# EasyEDA Pro project ProProject_智能小车驱动板V01_2024-07-14.epro

# Schematic Schematic1
Create Date: 2024-07-03; Page Name: P1; Project Name: 智能小车驱动板V01; Schematic Name: Schematic1; Update Date: 2024-07-11; Company: 嘉立创EDA; Page Size: A4; Version: V1.0
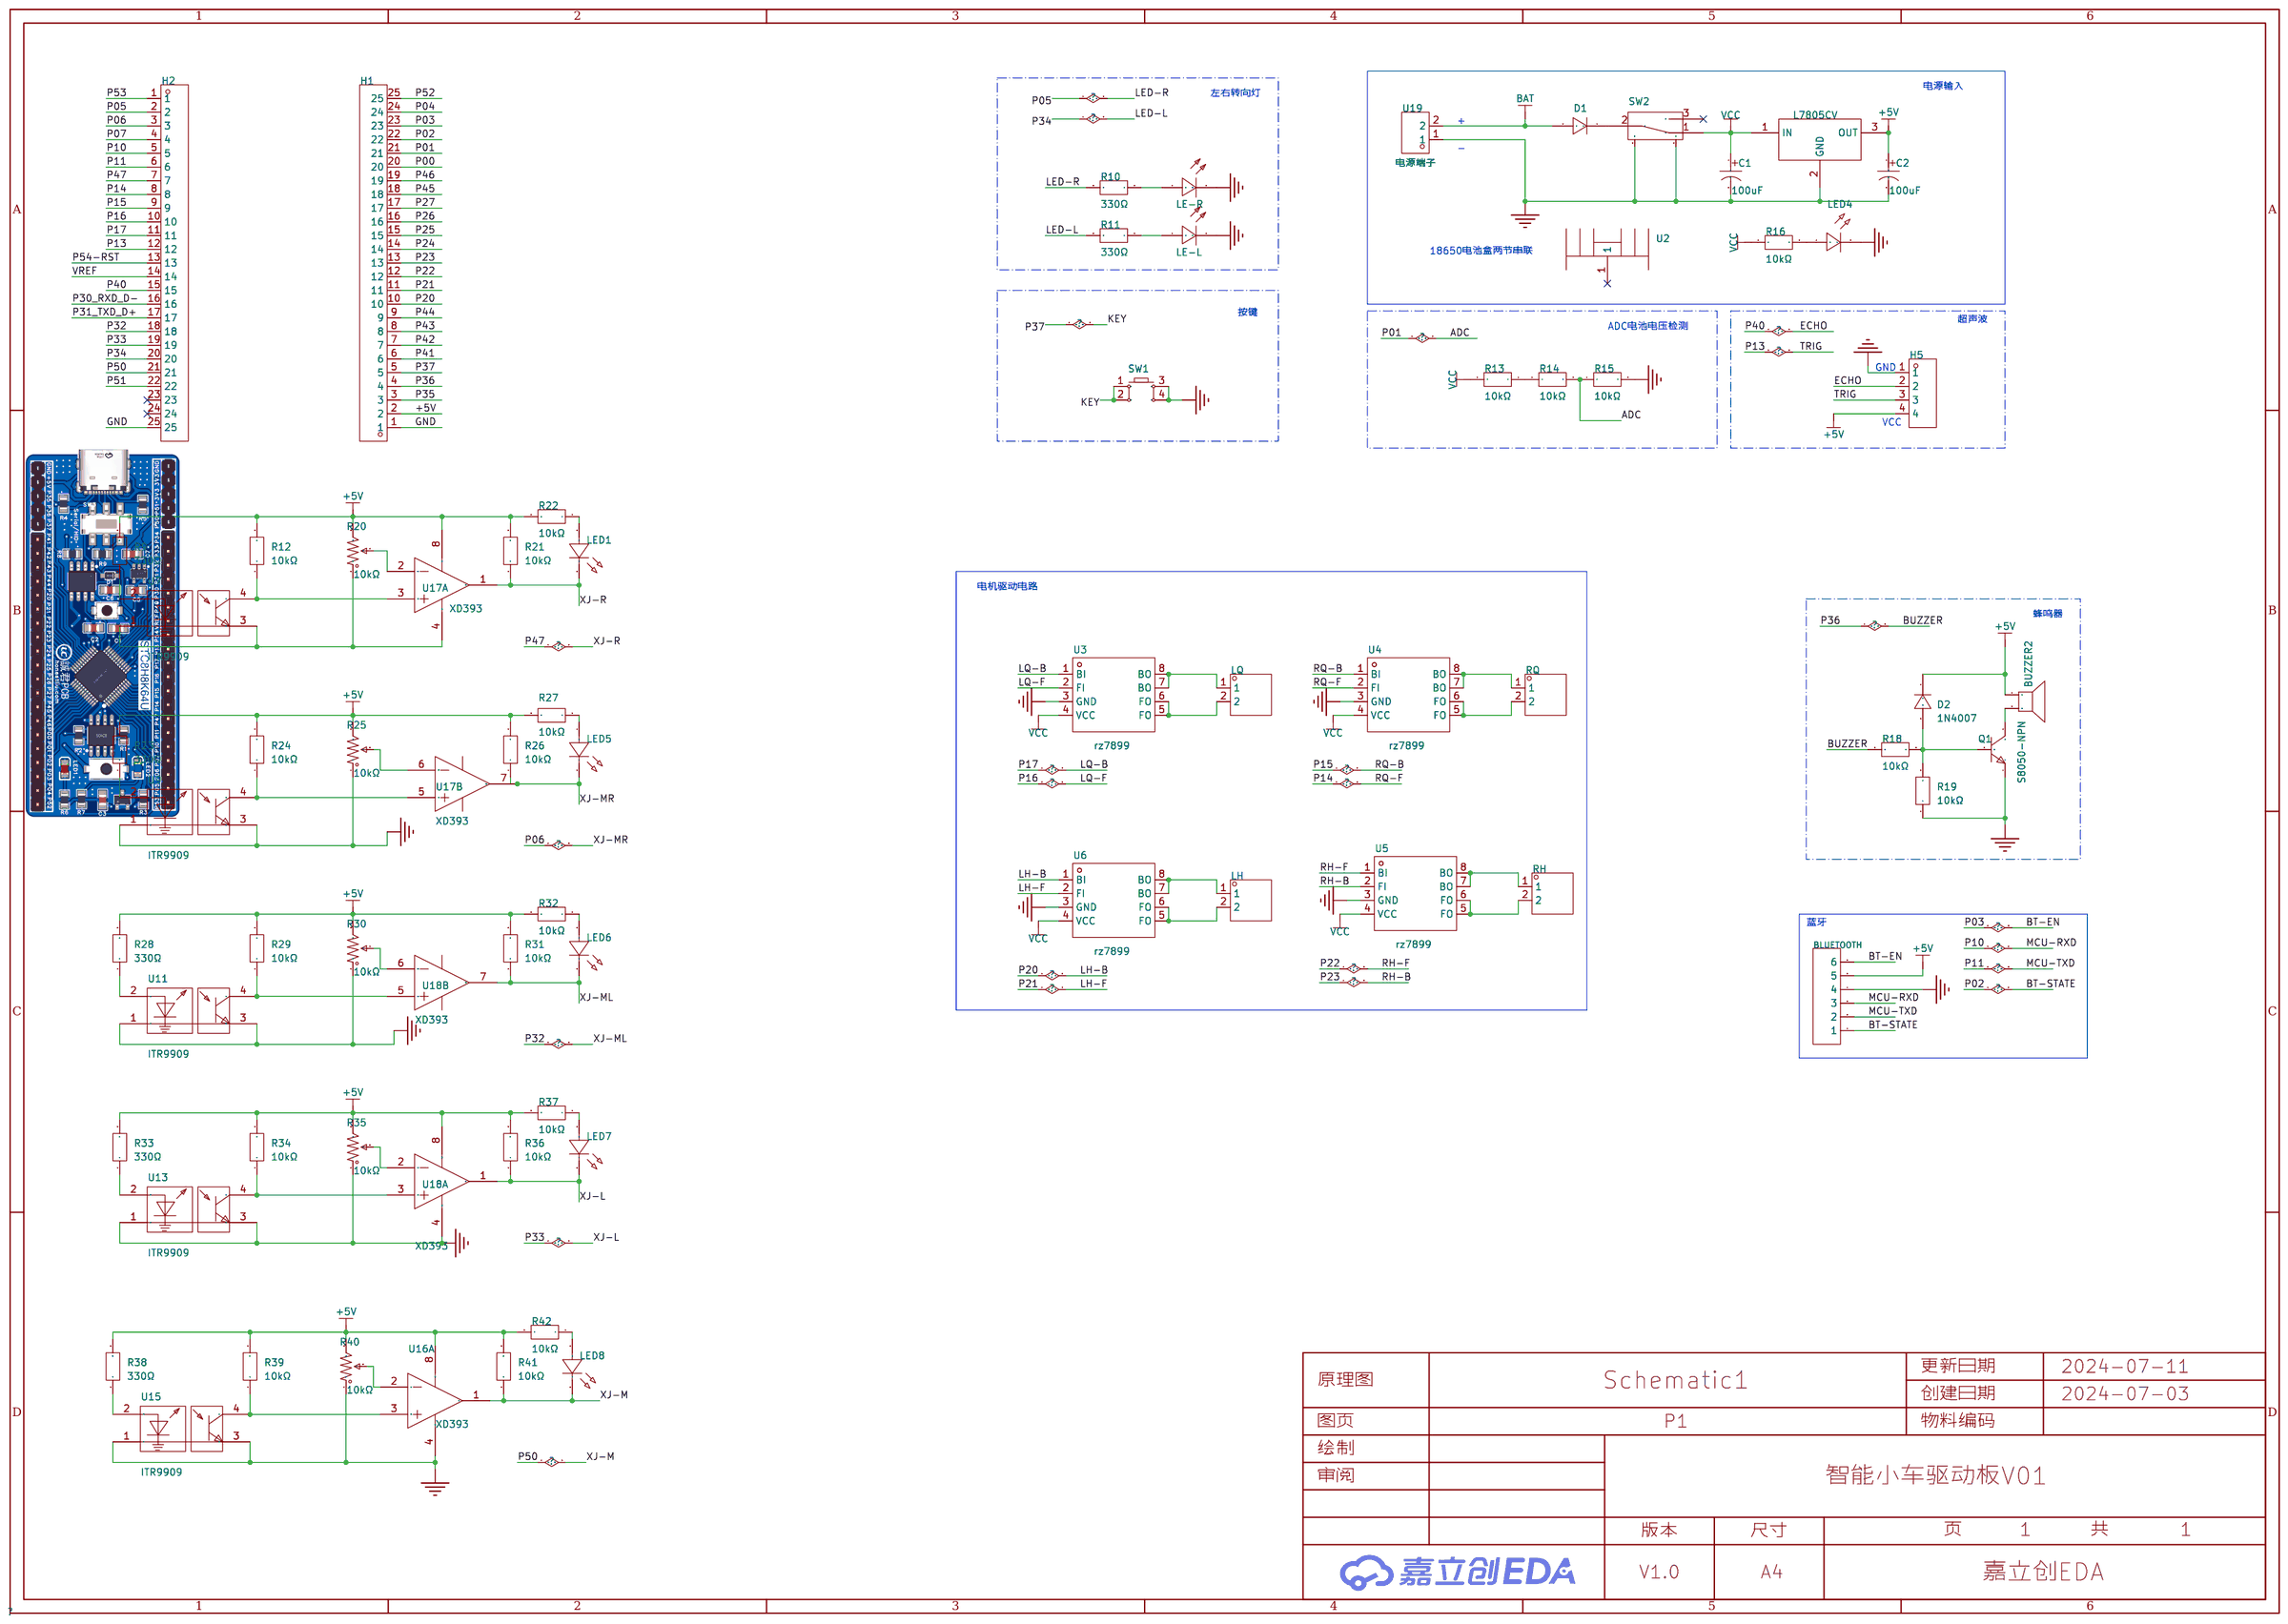
[diagram p0: schematic sheet]

## Parts
BLUETOOTH  -  [HDR-TH_6P-P2.54-V-M-1]
BUZZER2  SFN-12055PA6.5  [BUZ-TH_2P_SFN-12055PA6.5]
C1  100uF  [CAP-TH_BD6.3-P2.50-D1.0-FD]
C2  100uF  [CAP-TH_BD6.3-P2.50-D1.0-FD]
D1  1N4007  [DO-41_BD2.4-L4.7-P8.70-D0.9-RD]
D2  1N4007  [DO-41_BD2.4-L4.7-P8.70-D0.9-RD]
H1  X6511WV-25H-C60D30  [HDR-TH_25P-P2.54-V-M]
H2  X6511WV-25H-C60D30  [HDR-TH_25P-P2.54-V-M]
H5  -  [HDR-TH_4P-P2.54-V-M]
LE-L  TJ-L5FCMYGTDLSFLC6TW-A5  [LED-TH_BD5.8-P2.54-FD]
LE-R  TJ-L5FCMYGTDLSFLC6TW-A5  [LED-TH_BD5.8-P2.54-FD]
LED1  XL-302UGD  [LED-TH_BD3.8-P2.54-FD_GREEN]
LED4  -  [LED_TH-3mm]
LED5  XL-302UGD  [LED-TH_BD3.8-P2.54-FD_GREEN]
LED6  XL-302UGD  [LED-TH_BD3.8-P2.54-FD_GREEN]
LED7  XL-302UGD  [LED-TH_BD3.8-P2.54-FD_GREEN]
LED8  XL-302UGD  [LED-TH_BD3.8-P2.54-FD_GREEN]
LH  -  [HDR-TH_2P-P2.54-V-M-1]
LQ  -  [HDR-TH_2P-P2.54-V-M-1]
Q1  S8050-NPN  [TO-92-3_L4.8-W3.7-P2.54-L]
R9  330Ω  [RES-TH_BD2.3-L6.5-P10.50-D0.5]
R10  330Ω  [RES-TH_BD2.3-L6.5-P10.50-D0.5]
R11  330Ω  [RES-TH_BD2.3-L6.5-P10.50-D0.5]
R12  10kΩ  [RES-TH_BD2.4-L6.3-P10.30-D0.6]
R13  10kΩ  [RES-TH_BD2.4-L6.3-P10.30-D0.6]
R14  10kΩ  [RES-TH_BD2.4-L6.3-P10.30-D0.6]
R15  10kΩ  [RES-TH_BD2.4-L6.3-P10.30-D0.6]
R16  10kΩ  [RES-TH_BD2.4-L6.3-P10.30-D0.6]
R18  10kΩ  [RES-TH_BD2.4-L6.3-P10.30-D0.6]
R19  10kΩ  [RES-TH_BD2.4-L6.3-P10.30-D0.6]
R20  10kΩ  [RES-ADJ-TH_3P-L10.0-W10.0-P2.50-L]
R21  10kΩ  [RES-TH_BD2.4-L6.3-P10.30-D0.6]
R22  10kΩ  [RES-TH_BD2.4-L6.3-P10.30-D0.6]
R23  330Ω  [RES-TH_BD2.3-L6.5-P10.50-D0.5]
R24  10kΩ  [RES-TH_BD2.4-L6.3-P10.30-D0.6]
R25  10kΩ  [RES-ADJ-TH_3P-L10.0-W10.0-P2.50-L]
R26  10kΩ  [RES-TH_BD2.4-L6.3-P10.30-D0.6]
R27  10kΩ  [RES-TH_BD2.4-L6.3-P10.30-D0.6]
R28  330Ω  [RES-TH_BD2.3-L6.5-P10.50-D0.5]
R29  10kΩ  [RES-TH_BD2.4-L6.3-P10.30-D0.6]
R30  10kΩ  [RES-ADJ-TH_3P-L10.0-W10.0-P2.50-L]
R31  10kΩ  [RES-TH_BD2.4-L6.3-P10.30-D0.6]
R32  10kΩ  [RES-TH_BD2.4-L6.3-P10.30-D0.6]
R33  330Ω  [RES-TH_BD2.3-L6.5-P10.50-D0.5]
R34  10kΩ  [RES-TH_BD2.4-L6.3-P10.30-D0.6]
R35  10kΩ  [RES-ADJ-TH_3P-L10.0-W10.0-P2.50-L]
R36  10kΩ  [RES-TH_BD2.4-L6.3-P10.30-D0.6]
R37  10kΩ  [RES-TH_BD2.4-L6.3-P10.30-D0.6]
R38  330Ω  [RES-TH_BD2.3-L6.5-P10.50-D0.5]
R39  10kΩ  [RES-TH_BD2.4-L6.3-P10.30-D0.6]
R40  10kΩ  [RES-ADJ-TH_3P-L10.0-W10.0-P2.50-L]
R41  10kΩ  [RES-TH_BD2.4-L6.3-P10.30-D0.6]
R42  10kΩ  [RES-TH_BD2.4-L6.3-P10.30-D0.6]
RH  -  [HDR-TH_2P-P2.54-V-M-1]
RQ  -  [HDR-TH_2P-P2.54-V-M-1]
SW1  -  [Key_SMD_12x12x7.3]
SW2  SK-12E12-G5  [SW-TH_SK-12E12-G5]
U1  L7805CV  [TO-220-3_L10.0-W4.5-P2.54-L]
U2  15.5*10.5*24  [HEATSINK-TH_L15.5-W10.5-XSD1226-005]
U3  rz7899  [SOP-8_L4.9-W3.9-P1.27-LS6.0-BL]
U4  rz7899  [SOP-8_L4.9-W3.9-P1.27-LS6.0-BL]
U5  rz7899  [SOP-8_L4.9-W3.9-P1.27-LS6.0-BL]
U6  rz7899  [SOP-8_L4.9-W3.9-P1.27-LS6.0-BL]
U7  ITR9909  [OPTO-TH_ITR9909]
U9  ITR9909  [OPTO-TH_ITR9909]
U11  ITR9909  [OPTO-TH_ITR9909]
U13  ITR9909  [OPTO-TH_ITR9909]
U15  ITR9909  [OPTO-TH_ITR9909]
U16  XD393  [DIP-8_L9.7-W6.4-P2.54-LS7.6-BL]  (section 1)
U17  XD393  [DIP-8_L9.7-W6.4-P2.54-LS7.6-BL]  (sections 1,2)
U18  XD393  [DIP-8_L9.7-W6.4-P2.54-LS7.6-BL]  (sections 1,2)
U19  电源端子  [CONN-TH_2P-P3.81_DB125-3.81-2P-BK-S]

## Library data of the parts
BLUETOOTH = HDR-M_2.54_1x6P: Supplier Part: C37208; Supplier Footprint: 插件
BUZZER2 = SFN-12055PA6.5_C430917: Supplier Part: C430917; Supplier Footprint: Through Hole,P=6.5mm; JLCPCB Part Class: 扩展库; Supplier: LCSC
C1 C2 = KM107M035E11RR0VH2FP0: 容值:100uF;精度:±20%;额定电压:35V;纹波电流:168mA@120Hz;等效串联电阻:-;; LCSC Part Name: 100uF ±20% 35V; Supplier Part: C19504; Manufacturer: CX(承兴); Supplier Footprint: 插件,D6.3xL11mm; JLCPCB Part Class: 扩展库; Datasheet: https://atta.szlcsc.com/upload/public/pdf/source/20211027/06D6BA3719C264B639DC286D935D03EA.pdf; Supplier: LCSC; Tolerance: ±20%; Rated Voltage: 35V; Ripple Current: 168mA@120Hz; Lead Spacing: 2.5mm; φD: 6.3mm; L: 11mm; Lifetime @ Temp: 1000hrs@105℃
D1 D2 = 1N4007_C402311: 二极管配置:独立式;正向压降(Vf):1V;直流反向耐压(Vr):1kV;平均整流电流(Io):1A;; LCSC Part Name: 电压:1kV 电流:1A; Supplier Part: C402311; Manufacturer: LGE(鲁光); Supplier Footprint: DO-41; JLCPCB Part Class: 扩展库; Datasheet: https://atta.szlcsc.com/upload/public/pdf/source/20190705/C402311_D2D67FF606A14042155DA6DAFA20C736.pdf; Supplier: LCSC; Diode Configuration: 独立式; Forward Voltage (Vf@If): 1V; Reverse Voltage (Vr): 1kV; Average Rectified Current (Io): 1A; Reverse Leakage Current: 5uA
H1 H2 = X6511WV-25H-C60D30: 插针结构:1x25P;间距:2.54mm;行距:2.54mm;圆针/方针:方针;安装类型:-;排数:单排;总PIN位数:25P;额定电流:3A;额定电压:250V;配合针长度:6mm;塑高:2.5mm;端接针长度:3mm;触头材质:黄铜;触头镀层:金;工作温度范围:-40℃~+105℃;焊接温度(最大值):260℃;颜色:黑色;; LCSC Part Name: 1x25P 间距:2.54mm 方针; Supplier Part: C725957; Manufacturer: XKB Connection(中国星坤); Supplier Footprint: 插件,P=2.54mm; JLCPCB Part Class: 扩展库; Supplier: LCSC; Pin Structure: 1x25P; Pitch: 2.54mm; Row Spacing: 2.54mm; Circluar Pins/Square Pins: 方针; Number of Rows: 单排; Number of Pins: 25P; Current Rating (Max): 3A; Voltage Rating (Max): 250V; Length of Mating Pin: 6mm; Insulation Height: 2.5mm; Length of End Connection Pin: 3mm; Contact Material: 黄铜; Contact Plating: 金; Operating Temperature Range: -40℃~+105℃; Soldering Temperature(Max): 260℃; Color: 黑色
H5 = HDR-M_2.54_1x4P: Supplier Part: C492403; Supplier Footprint: 插件
LE-L LE-R = TJ-L5FCMYGTDLSFLC6TW-A5: 灯头类型:5mm圆形灯头;发光颜色:白色;; LCSC Part Name: 白灯; Supplier Part: C331025; Manufacturer: TOGIALED(统佳); Supplier Footprint: 插件,D=5mm; JLCPCB Part Class: 扩展库; Datasheet: https://atta.szlcsc.com/upload/public/pdf/source/20190107/C331025_3C86FA64154A6CCDAF3EF0231B5ACE43.pdf; Supplier: LCSC; Lamp Holder Type: 5mm圆形灯头; Emitted Color: 白色
LED1 LED5-LED8 = XL-302UGD: 灯头类型:3mm圆形灯头;发光颜色:翠绿色;功率:80mW;正向电流:30mA;主波长:510nm~520nm;透镜颜色:绿色透镜;色温:-;发光角度:50°;载带方式:-;工作温度:-25℃~+85℃;; Supplier Part: C2895476; Manufacturer: XINGLIGHT(成兴光); Supplier Footprint: 插件,D=3mm; JLCPCB Part Class: 扩展库; Datasheet: https://atta.szlcsc.com/upload/public/pdf/source/20240112/A4C1FE2F91E20BD07CDB872CEF78D7A0.pdf; Supplier: LCSC; Lamp Holder Type: 3mm圆形灯头; Emitted Color: 翠绿色; Power Dissipation: 80mW; Forward Current: 30mA; Dominant Wavelength: 510nm~520nm; Peak Wavelength: 525nm; Lens Color: 绿色透镜; Viewing Angle: 50°; Operating Temperature: -25℃~+85℃
LED4 = LED_TH-R_3mm: Supplier Footprint: 插件
LH LQ RH RQ = HDR-M_2.54_1x2P: Supplier Part: C124375; Supplier Footprint: 插件
Q1 = SS8050-TA: 晶体管类型:NPN;集电极电流(Ic):1.5A;集射极击穿电压(Vceo):25V;功率(Pd):1W;直流电流增益(hFE@Ic,Vce):160@100mA,1V;; LCSC Part Name: SS8050-TA(RANGE:160-300) hfe=160~300; Supplier Part: C80297; Manufacturer: CJ(江苏长电/长晶); Supplier Footprint: TO-92-3; JLCPCB Part Class: 扩展库; Datasheet: https://atta.szlcsc.com/upload/public/pdf/source/20160806/1470478006169.pdf; Supplier: LCSC; Transistor Type: NPN; Collector Current (Ic): 1.5A; Collector-Emitter Breakdown Voltage (Vceo): 25V; Power Dissipation (Pd): 1W; DC Current Gain (hFE@Ic,Vce): 160@100mA,1V; Transition Frequency (fT): 100MHz; Collector Cut-Off Current (Icbo): 100nA; Collector-Emitter Saturation Voltage (VCE(sat)@Ic,Ib): 500mV@800mA,80mA
R9-R11 R23 R28 R33 R38 = MF1/4W-330Ω±1%T52: 电阻类型:金属膜电阻;阻值:330Ω;精度:±1%;功率:250mW;温度系数:±200ppm/℃;; LCSC Part Name: 金属膜电阻 330Ω ±1% 250mW; Supplier Part: C713986; Manufacturer: 华星机电; Supplier Footprint: 插件,D2.3xL6.5mm; JLCPCB Part Class: 扩展库; Datasheet: https://atta.szlcsc.com/upload/public/pdf/source/20200731/C713882_AE8EB1102749D7E4FB4FB13DC898C429.pdf; Supplier: LCSC; Type: 金属膜电阻; Tolerance: ±1%; Power(Watts): 250mW; Temperature Coefficient: ±200ppm/℃
R12-R16 R18 R19 R21 R22 R24 R26 R27 R29 R31 R32 R34 R36 R37 R39 R41 R42 = RN1/4W10KFT/BA1: 电阻类型:金属膜电阻;阻值:10kΩ;精度:±1%;功率:250mW;温度系数:±50ppm/℃;; LCSC Part Name: 10kΩ ±1% 250mW 金属膜电阻; Supplier Part: C410695; Manufacturer: Tyohm(幸亚电阻); Supplier Footprint: 插件,D2.4xL6.5mm; JLCPCB Part Class: 扩展库; Datasheet: https://atta.szlcsc.com/upload/public/pdf/source/20190808/C410699_D126E64D28B638F1D73B58E9F61DFD9B.pdf; Supplier: LCSC; Type: 金属膜电阻; Tolerance: ±1%; Overload Voltage (Max): 250V; Power(Watts): 250mW; Temperature Coefficient: ±50ppm/℃; Operating Temperature Range: -55℃~+125℃
R20 R25 R30 R35 R40 = 3296W-1-103: 阻值:10kΩ;精度:±10%;; LCSC Part Name: 10kΩ ±10%; Supplier Part: C118954; Manufacturer: BOCHEN(博晨); Supplier Footprint: 插件; JLCPCB Part Class: 扩展库; Datasheet: https://atta.szlcsc.com/upload/public/pdf/source/20171114/C118954_15106326646611117443.pdf; Supplier: LCSC; Tolerance: ±10%
SW1 = Key_SMD_12x12x7.3: Supplier Footprint: SMD
SW2 = SK-12E12-G5: 电路结构:单刀双掷;安装方式:侧插;额定电流(DC):-;额定电压(DC):-;额定电流(AC):-;额定电压(AC):-;机械寿命:5千次;; LCSC Part Name: 卧插双档 滑动开关; Supplier Part: C136720; Manufacturer: 韩国韩荣; Supplier Footprint: 插件; JLCPCB Part Class: 扩展库; Datasheet: https://atta.szlcsc.com/upload/public/pdf/source/20210810/880D64C2F8CCE477762EFCC00B7B7681.pdf; Supplier: LCSC; Circuit: 单刀双掷; Actuator Style: 矩形柱状; Pin Style: PC引脚; Switch Height: 10.6mm; Mounting Style: 侧插; Mechanical Life: 5千次; Operating Temperature: -25℃~+70℃
U1 = L7805CV_C111887: 输出类型:固定;最大输入电压:35V;输出电压:5V;最大输出电流:1.5A;电源纹波抑制比(PSRR):62dB@(120Hz);输出极性:正极;; LCSC Part Name: 输入35V 输出5V 1.5A; Supplier Part: C111887; Manufacturer: ST(意法半导体); Supplier Footprint: TO-220; JLCPCB Part Class: 扩展库; Datasheet: https://atta.szlcsc.com/upload/public/pdf/source/20180606/C192854_20B6D8F8F52B6FFCE5644906251095FD.pdf; Supplier: LCSC; Output Type: 固定; Maximum Input Voltage: 35V; Output Voltage: 5V; MAX Output Current: 1.5A; Power Supply Rejection Ratio (PSRR): 62dB@(120Hz); Dropout Voltage: 2V@(1A); standby current: 8mA; Operating Temperature: 0℃~+125℃; Output Polarity: 正极; Number of Outputs: 1
U2 = 15.5*10.5*24: 产品尺寸:15.5*10.5*24MM;材 质:6063-T5;; LCSC Part Name: 散热片15.5*10.5*24 带针 H型; Supplier Part: C108928; Manufacturer: XSD(鑫顺达); JLCPCB Part Class: 扩展库; Datasheet: https://atta.szlcsc.com/upload/public/pdf/source/20180614/C108928_606EC6D8E4D943F4065E73A7656775A1.pdf; Supplier: LCSC; ProductSize: 15.5*10.5*24MM; Colour: 白色; TextureOfMaterial: 6063-T5; SurfaceTreatment: 本色洗白; Shape: H型; type: -；-；-；-；-；-；-
U3-U6 = rz7899: 25V 4A 控制直流电机正反转; Supplier Part: C92373; Manufacturer: RZ(睿智微); Supplier Footprint: SOP-8; JLCPCB Part Class: 扩展库; Datasheet: https://atta.szlcsc.com/upload/public/pdf/source/20170213/1486965283321.pdf; Supplier: LCSC
U7 U9 U11 U13 U15 = ITR9909: 感应距离:-;集电极电流(最大值):50mA;; Supplier Part: C53399; Manufacturer: EVERLIGHT(亿光); Supplier Footprint: DIP-4; JLCPCB Part Class: 扩展库; Datasheet: https://atta.szlcsc.com/upload/public/pdf/source/20201022/C53399_E5C79523D84B21DC4419F8E709CCCF2E.pdf; Supplier: LCSC; Collector Current (Max): 50mA
U16-U18 = XD393: 双路差动比较器; LCSC Part Name: 模拟比较器; Supplier Part: C561266; Manufacturer: XINLUDA(信路达); Supplier Footprint: DIP-8; JLCPCB Part Class: 扩展库; Datasheet: https://atta.szlcsc.com/upload/public/pdf/source/20231018/3B89D7569C380B4DE81253B2CBD8E154.pdf; Supplier: LCSC
U19 = DB125-3.81-2P-BK-S: 结构:1x2P;间距:3.81mm;颜色:黑色;安装方式:直插;额定电流:10A;额定电压:300V;排数:1;线规 - AWG:16~26;线规 - 平方毫米:0.5~1;每排PIN数:2;工作温度范围:-40℃~+105℃;; LCSC Part Name: 3.81mm 1x2P 排数:1 每排P数:2 直插; Supplier Part: C430618; Manufacturer: DORABO(地博电气); Supplier Footprint: 插件,P=3.81mm; JLCPCB Part Class: 扩展库; Datasheet: https://atta.szlcsc.com/upload/public/pdf/source/20220823/CB89165D0F406880B925A92BEEA3FB50.pdf; Supplier: LCSC; Structure: 1x2P; Pitch: 3.81mm; Color: 黑色; Mounting Style: 直插; Current Rating (Max): 10A; Voltage Rating (Max): 300V; Number of Pins: 2P; Number of Rows: 1; Wire Gauge - AWG: 16~26; Wire Gauge - mm2: 0.5~1; Number of PINs Per Row: 2; Operating Temperature Range: -40℃~+105℃

## Nets
+5V: BLUETOOTH.5 BUZZER2.1 C2.1 D2.1 H1.2 H5.4 R9.2 R12.2 R20.3 R21.2 R22.2 R23.2 R24.2 R25.3 R26.2 R27.2 R28.2 R29.2 R30.3 R31.2 R32.2 R33.2 R34.2 R35.3 R36.2 R37.2 R38.2 R39.2 R40.3 R41.2 R42.2 U1.3(OUT) U16.8(VCC) U17.8(VCC) U18.8(VCC)
GND: BLUETOOTH.4 C1.2 C2.2 H1.1 H2.25 H5.1 LE-L.2 LE-R.2 LED4.2(A) Q1.1(E) R15.2 R19.1 R25.1 R30.1 R35.1 R40.1 SW1.3 SW1.4 SW2.4 SW2.5 U1.2(GND) U3.3(GND) U4.3(GND) U5.3(GND) U6.3(GND) U9.1 U9.3 U11.1 U11.3 U13.1 U13.3 U15.1 U15.3 U16.4(GND) U18.4(GND) U19.1
VCC: C1.1 R13.2 R16.1 SW2.1 U1.1(IN) U3.4(VCC) U4.4(VCC) U5.4(VCC) U6.4(VCC)
ADC: H1.21 R14.2 R15.1
BAT: D1.2 U19.2
BT-EN: BLUETOOTH.6 H1.23
BT-STATE: BLUETOOTH.1 H1.22
BUZZER: H1.4 R18.1
ECHO: H2.15 H5.2
KEY: H1.5 SW1.1 SW1.2
LED-L: H2.20 R11.2
LED-R: H2.2 R10.2
LH-B: H1.10 U6.1(BI)
LH-F: H1.11 U6.2(FI)
LQ-B: H2.11 U3.1(BI)
LQ-F: H2.10 U3.2(FI)
MCU-RXD: BLUETOOTH.3 H2.5
MCU-TXD: BLUETOOTH.2 H2.6
P00: H1.20
P04: H1.24
P06: H2.3 LED5.2(K) R26.1 U17.7(OUT2)
P07: H2.4
P13: H2.12 H5.3
P14: H2.8 U4.2(FI)
P15: H2.9 U4.1(BI)
P22: H1.12 U5.1(BI)
P23: H1.13 U5.2(FI)
P24: H1.14
P25: H1.15
P26: H1.16
P27: H1.17
P30_RXD_D-: H2.16
P31_TXD_D+: H2.17
P32: H2.18 LED6.2(K) R31.1 U18.7(OUT2)
P33: H2.19 LED7.2(K) R36.1 U18.1(OUT1)
P35: H1.3
P41: H1.6
P42: H1.7
P43: H1.8
P44: H1.9
P45: H1.18
P46: H1.19
P47: H2.7 LED1.2(K) R21.1 U17.1(OUT1)
P50: H2.21 LED8.2(K) R41.1 U16.1(OUT1)
P51: H2.22
P52: H1.25
P53: H2.1
P54-RST: H2.13
VREF: H2.14
$1N755: LE-R.1 R10.1
$1N758: LE-L.1 R11.1
$1N1456: D1.1 SW2.2
$1N3806: LQ.1 U3.7(BO) U3.8(BO)
$1N3817: LQ.2 U3.5(FO) U3.6(FO)
$1N4327: RQ.1 U4.7(BO) U4.8(BO)
$1N4331: RQ.2 U4.5(FO) U4.6(FO)
$1N4484: RH.1 U5.7(BO) U5.8(BO)
$1N4488: RH.2 U5.5(FO) U5.6(FO)
$1N4641: LH.1 U6.7(BO) U6.8(BO)
$1N4645: LH.2 U6.5(FO) U6.6(FO)
$1N5248: R13.1 R14.1
$1N5403: LED4.1(C) R16.2
$1N6037: LED1.1(A) R22.1
$1N6091: R9.1 U7.2
$1N6569: LED5.1(A) R27.1
$1N6571: R23.1 U9.2
$1N6573: R25.2 U17.6(IN2-)
$1N6588: R24.1 U9.4 U17.5(IN2+)
$1N6939: LED6.1(A) R32.1
$1N6941: R28.1 U11.2
$1N6943: R30.2 U18.6(IN2-)
$1N6958: R29.1 U11.4 U18.5(IN2+)
$1N7309: LED7.1(A) R37.1
$1N7311: R33.1 U13.2
$1N7313: R35.2 U18.2(IN1-)
$1N7328: R34.1 U13.4 U18.3(IN1+)
$1N14798: LED8.1(A) R42.1
$1N14800: R38.1 U15.2
$1N14802: R40.2 U16.2(IN1-)
$1N14817: R39.1 U15.4 U16.3(IN1+)
$1N14919: BUZZER2.2 Q1.3(C)
$1N14930: D2.2 Q1.2(B) R18.2 R19.2
$1N14943: R20.2 U17.2(IN1-)
$1N14947: R12.1 U7.4 U17.3(IN1+)
$1N14951: R20.1 U7.1 U7.3 U17.4(GND)

Not connected (* = marked no-connect by the designer): H2 23* 24*; SW2 3*; U2 1*

## Notes on the sheet
- 电源输入
- 左右转向灯
- +
- -
- 18650电池盒两节串联
- 按键
- 超声波
- ADC电池电压检测
- GND
- VCC
- 电机驱动电路
- 蜂鸣器
- 蓝牙

# Board PCB1
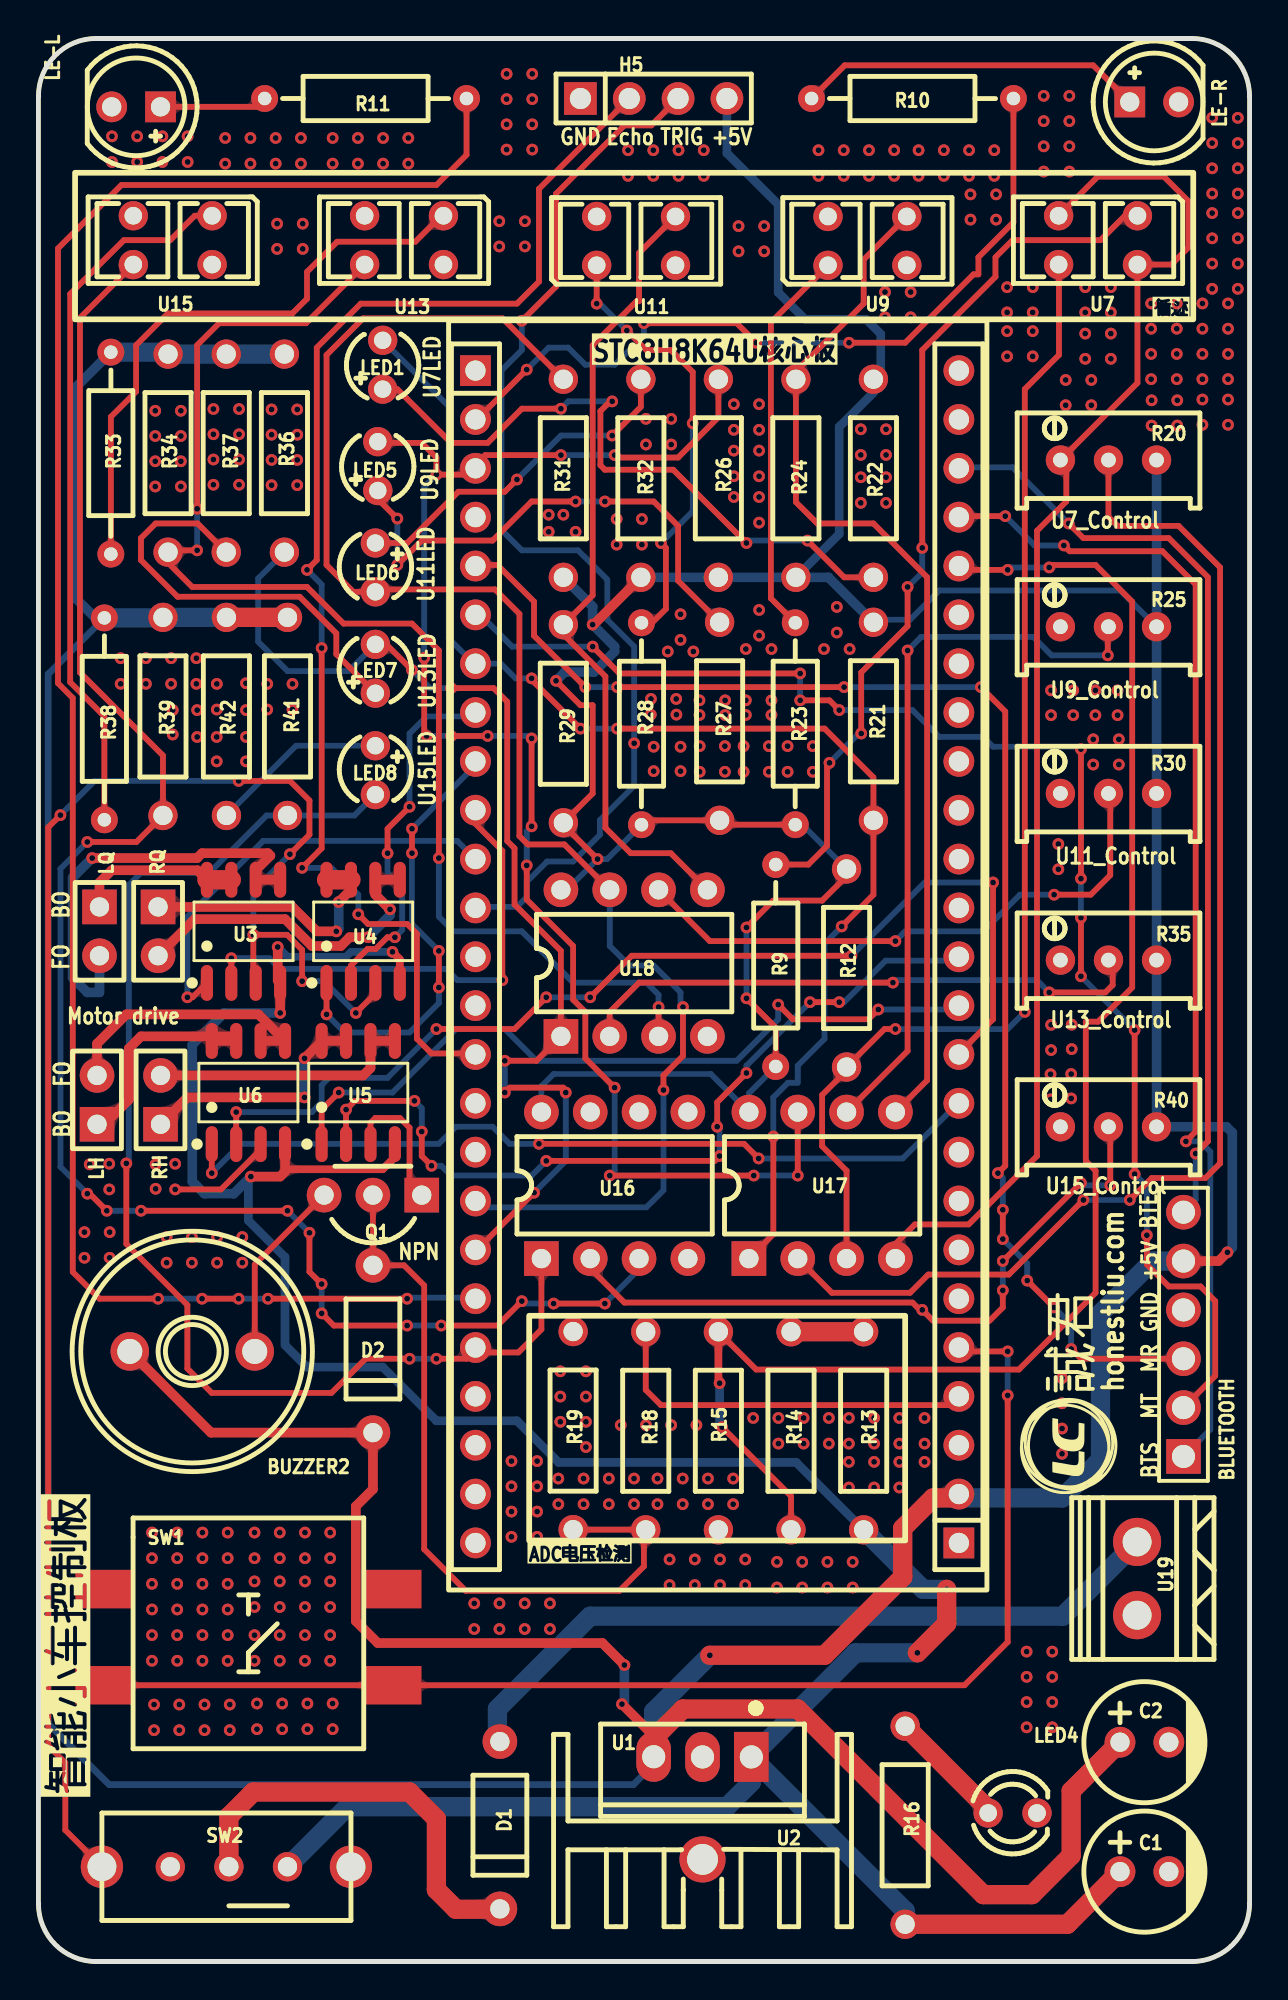
[diagram p1: board, top side]
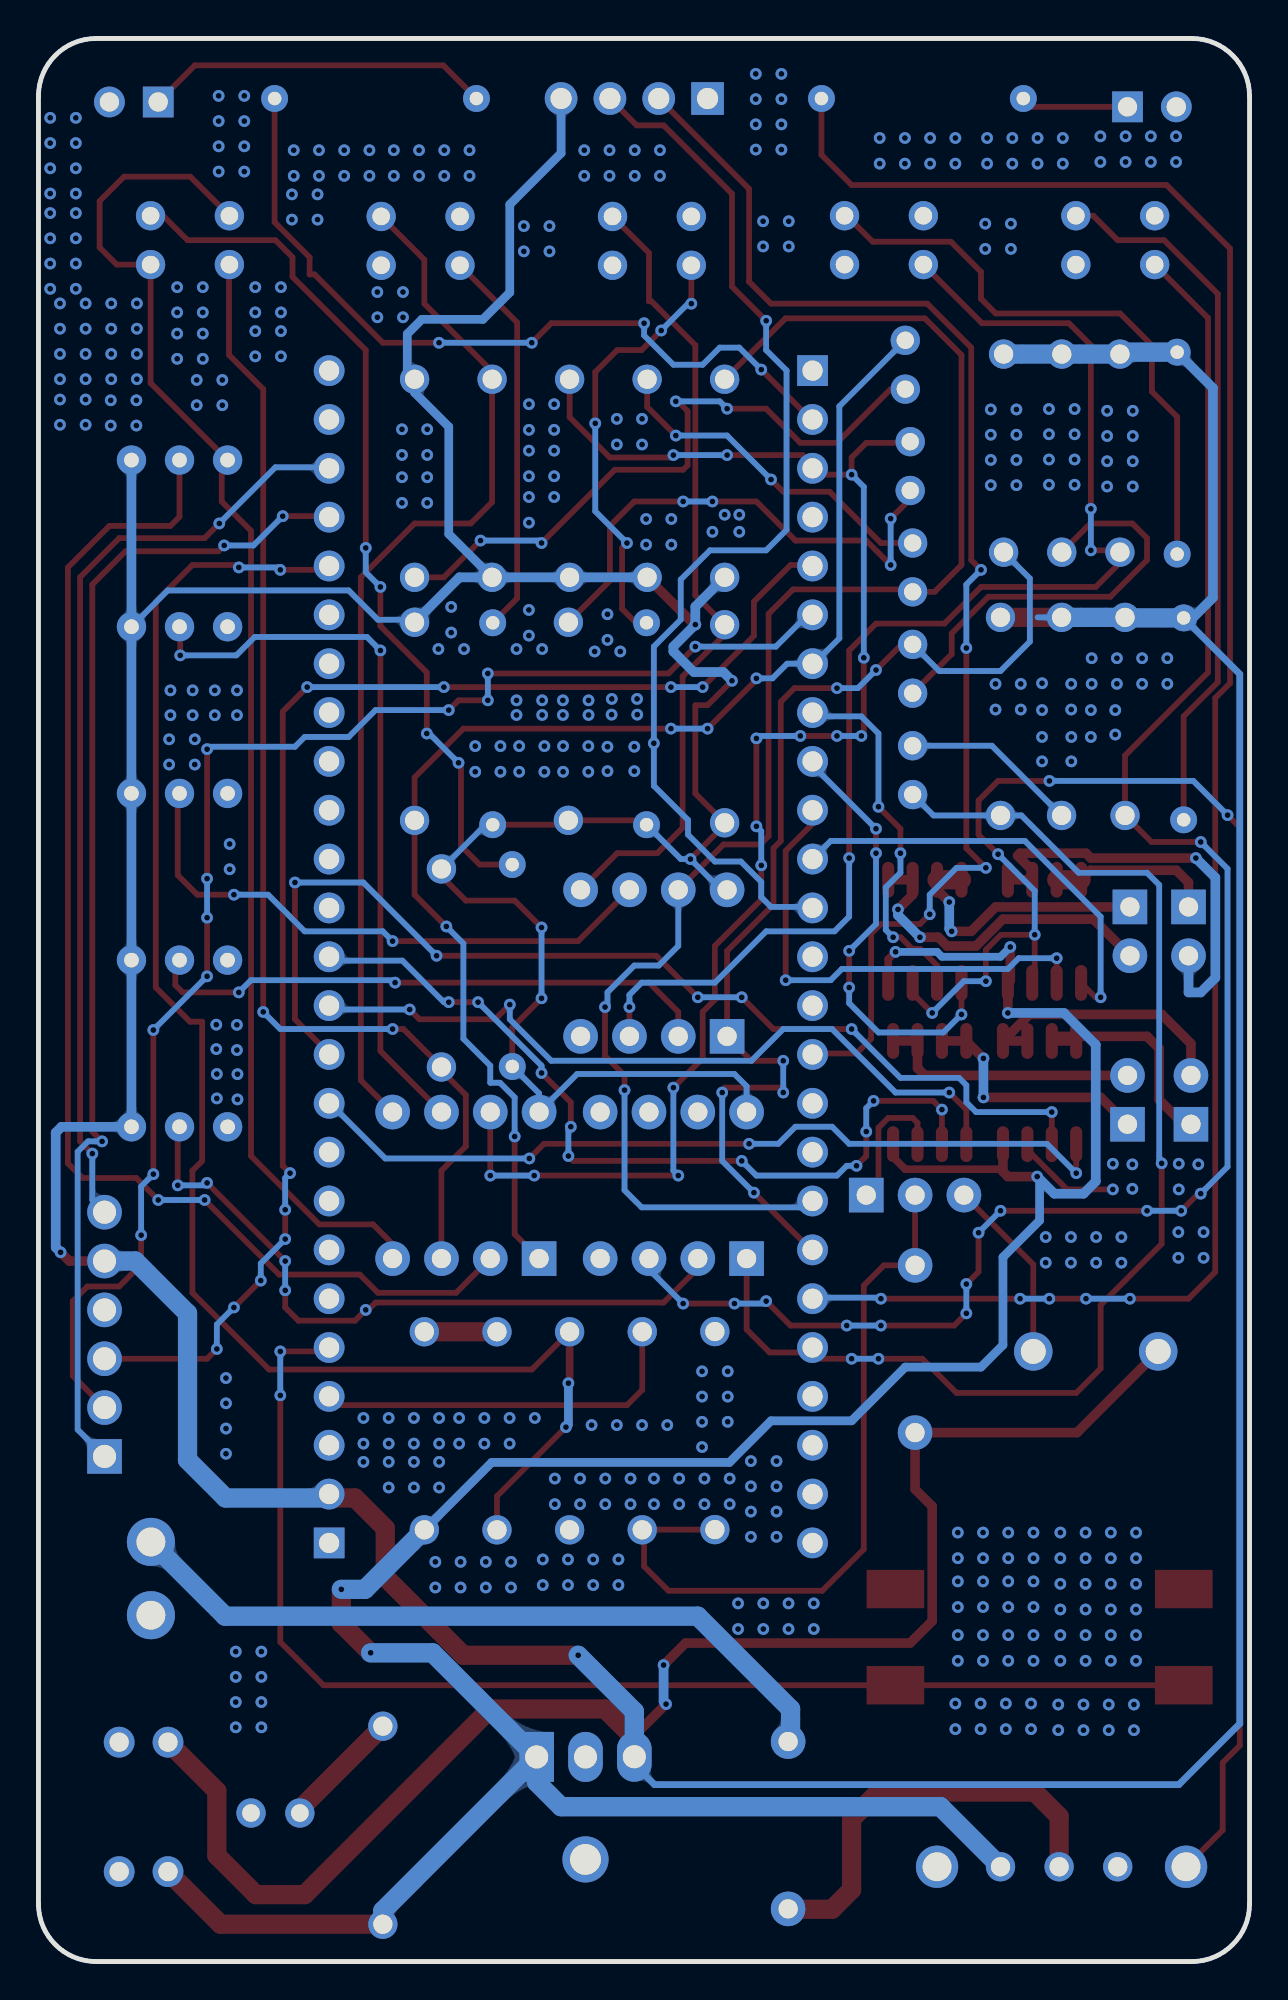
[diagram p2: board, bottom side, seen from below]

Outline 63 x 100 mm; copper layers: Top Layer, Bottom Layer. Coordinates in mm from the lower left corner of the outline.
Outline path: 0,97 0,3 arc(0.88,0.88) 3,0 60,0 arc(62.12,0.88) 63,3 63,97 arc(62.12,99.12) 60,100 3,100 arc(0.88,99.12) 0,97
Stack: Top Layer 0.035mm / Dielectric1 1.51mm FR4 er 4.5 / Bottom Layer 0.035mm

## Design rules (mm)
template: JLCPCB Capability(Two Layers Board)
spacing copperThickness1oz (default): track to track 0.102, other pairs 0.152 to 0.3
spacing copperThickness2oz: track to track 0.203, other pairs 0.152 to 0.3
track width copperThickness1oz (default): min 0.127, default 0.254, max 2.54
track width copperThickness2oz: min 0.203, default 0.254, max 2.54
differential pair differentialPair (default): width min 0.127, default 0.254, max 2.54; gap min 0.152, default 0.152
via viaSize (default): diameter min 0.5, default 0.61, max 10; hole min 0.3, default 0.305, max 6.3

## Placement (name value [footprint] x y rotation side)
BLUETOOTH  -  [HDR-TH_6P-P2.54-V-M-1]  59.56 32.62 90 top
BUZZER2  SFN-12055PA6.5  [BUZ-TH_2P_SFN-12055PA6.5]  8 31.73 0 top
C1  100uF  [CAP-TH_BD6.3-P2.50-D1.0-FD]  57.53 4.68 0 top
C2  100uF  [CAP-TH_BD6.3-P2.50-D1.0-FD]  57.53 11.41 0 top
D1  1N4007  [DO-41_BD2.4-L4.7-P8.70-D0.9-RD]  24 7.09 90 top
D2  1N4007  [DO-41_BD2.4-L4.7-P8.70-D0.9-RD]  17.4 31.85 90 top
H1  X6511WV-25H-C60D30  [HDR-TH_25P-P2.54-V-M]  47.88 52.25 90 top
H2  X6511WV-25H-C60D30  [HDR-TH_25P-P2.54-V-M]  22.73 52.25 270 top
H5  -  [HDR-TH_4P-P2.54-V-M]  32 96.88 0 top
LE-L  TJ-L5FCMYGTDLSFLC6TW-A5  [LED-TH_BD5.8-P2.54-FD]  5.08 96.44 180 top
LE-R  TJ-L5FCMYGTDLSFLC6TW-A5  [LED-TH_BD5.8-P2.54-FD]  58.04 96.7 0 top
LED1  XL-302UGD  [LED-TH_BD3.8-P2.54-FD_GREEN]  17.91 83.03 90 top
LED4  -  [LED_TH-3mm]  50.67 7.72 0 top
LED5  XL-302UGD  [LED-TH_BD3.8-P2.54-FD_GREEN]  17.65 77.76 90 top
LED6  XL-302UGD  [LED-TH_BD3.8-P2.54-FD_GREEN]  17.53 72.49 270 top
LED7  XL-302UGD  [LED-TH_BD3.8-P2.54-FD_GREEN]  17.53 67.22 90 top
LED8  XL-302UGD  [LED-TH_BD3.8-P2.54-FD_GREEN]  17.53 61.95 270 top
LH  -  [HDR-TH_2P-P2.54-V-M-1]  3.05 44.81 90 top
LQ  -  [HDR-TH_2P-P2.54-V-M-1]  3.18 53.57 270 top
Q1  S8050-NPN  [TO-92-3_L4.8-W3.7-P2.54-L]  17.4 39.85 180 top
R9  330Ω  [RES-TH_BD2.3-L6.5-P10.50-D0.5]  38.35 51.79 270 top
R10  330Ω  [RES-TH_BD2.3-L6.5-P10.50-D0.5]  45.47 96.88 0 top
R11  330Ω  [RES-TH_BD2.3-L6.5-P10.50-D0.5]  17.02 96.88 0 top
R12  10kΩ  [RES-TH_BD2.4-L6.3-P10.30-D0.6]  42.04 51.67 90 top
R13  10kΩ  [RES-TH_BD2.4-L6.3-P10.30-D0.6]  42.93 27.6 270 top
R14  10kΩ  [RES-TH_BD2.4-L6.3-P10.30-D0.6]  39.15 27.6 270 top
R15  10kΩ  [RES-TH_BD2.4-L6.3-P10.30-D0.6]  35.37 27.6 270 top
R16  10kΩ  [RES-TH_BD2.4-L6.3-P10.30-D0.6]  45.08 7.09 90 top
R18  10kΩ  [RES-TH_BD2.4-L6.3-P10.30-D0.6]  31.59 27.6 270 top
R19  10kΩ  [RES-TH_BD2.4-L6.3-P10.30-D0.6]  27.81 27.61 270 top
R20  10kΩ  [RES-ADJ-TH_3P-L10.0-W10.0-P2.50-L]  55.66 78.08 0 top
R21  10kΩ  [RES-TH_BD2.4-L6.3-P10.30-D0.6]  43.43 64.49 90 top
R22  10kΩ  [RES-TH_BD2.4-L6.3-P10.30-D0.6]  43.43 77.13 90 top
R23  330Ω  [RES-TH_BD2.3-L6.5-P10.50-D0.5]  39.37 64.37 270 top
R24  10kΩ  [RES-TH_BD2.4-L6.3-P10.30-D0.6]  39.4 77.13 270 top
R25  10kΩ  [RES-ADJ-TH_3P-L10.0-W10.0-P2.50-L]  55.66 69.41 0 top
R26  10kΩ  [RES-TH_BD2.4-L6.3-P10.30-D0.6]  35.37 77.13 270 top
R27  10kΩ  [RES-TH_BD2.4-L6.3-P10.30-D0.6]  35.43 64.49 270 top
R28  330Ω  [RES-TH_BD2.3-L6.5-P10.50-D0.5]  31.37 64.37 270 top
R29  10kΩ  [RES-TH_BD2.4-L6.3-P10.30-D0.6]  27.3 64.37 270 top
R30  10kΩ  [RES-ADJ-TH_3P-L10.0-W10.0-P2.50-L]  55.66 60.74 0 top
R31  10kΩ  [RES-TH_BD2.4-L6.3-P10.30-D0.6]  27.3 77.13 270 top
R32  10kΩ  [RES-TH_BD2.4-L6.3-P10.30-D0.6]  31.34 77.13 270 top
R33  330Ω  [RES-TH_BD2.3-L6.5-P10.50-D0.5]  3.77 78.44 90 top
R34  10kΩ  [RES-TH_BD2.4-L6.3-P10.30-D0.6]  6.74 78.44 90 top
R35  10kΩ  [RES-ADJ-TH_3P-L10.0-W10.0-P2.50-L]  55.66 52.07 0 top
R36  10kΩ  [RES-TH_BD2.4-L6.3-P10.30-D0.6]  12.79 78.44 90 top
R37  10kΩ  [RES-TH_BD2.4-L6.3-P10.30-D0.6]  9.77 78.44 90 top
R38  330Ω  [RES-TH_BD2.3-L6.5-P10.50-D0.5]  3.43 64.62 90 top
R39  10kΩ  [RES-TH_BD2.4-L6.3-P10.30-D0.6]  6.48 64.75 90 top
R40  10kΩ  [RES-ADJ-TH_3P-L10.0-W10.0-P2.50-L]  55.66 43.41 0 top
R41  10kΩ  [RES-TH_BD2.4-L6.3-P10.30-D0.6]  12.95 64.75 90 top
R42  10kΩ  [RES-TH_BD2.4-L6.3-P10.30-D0.6]  9.78 64.75 90 top
RH  -  [HDR-TH_2P-P2.54-V-M-1]  6.35 44.81 90 top
RQ  -  [HDR-TH_2P-P2.54-V-M-1]  6.22 53.57 270 top
SW1  -  [Key_SMD_12x12x7.3]  10.92 16.87 0 top
SW2  SK-12E12-G5  [SW-TH_SK-12E12-G5]  9.78 4.93 270 top
U1  L7805CV  [TO-220-3_L10.0-W4.5-P2.54-L]  34.54 10.64 180 top
U2  15.5*10.5*24  [HEATSINK-TH_L15.5-W10.5-XSD1226-005]  34.54 5.31 180 top
U3  rz7899  [SOP-8_L4.9-W3.9-P1.27-LS6.0-BL]  10.67 53.57 0 top
U4  rz7899  [SOP-8_L4.9-W3.9-P1.27-LS6.0-BL]  16.89 53.57 0 top
U5  rz7899  [SOP-8_L4.9-W3.9-P1.27-LS6.0-BL]  16.64 45.19 0 top
U6  rz7899  [SOP-8_L4.9-W3.9-P1.27-LS6.0-BL]  10.92 45.19 0 top
U7  ITR9909  [OPTO-TH_ITR9909]  55.12 89.51 180 top
U9  ITR9909  [OPTO-TH_ITR9909]  43.12 89.47 0 top
U11  ITR9909  [OPTO-TH_ITR9909]  31.09 89.47 0 top
U13  ITR9909  [OPTO-TH_ITR9909]  19.02 89.51 180 top
U15  ITR9909  [OPTO-TH_ITR9909]  6.98 89.51 180 top
U16  XD393  [DIP-8_L9.7-W6.4-P2.54-LS7.6-BL]  29.97 40.36 0 top
U17  XD393  [DIP-8_L9.7-W6.4-P2.54-LS7.6-BL]  40.77 40.36 0 top
U18  XD393  [DIP-8_L9.7-W6.4-P2.54-LS7.6-BL]  30.99 51.92 0 top
U19  电源端子  [CONN-TH_2P-P3.81_DB125-3.81-2P-BK-S]  57.15 19.92 90 top

## Footprints (pads in the part's own frame, mm; a bottom-side part is the same pattern mirrored in y, then rotated)
BUZ-TH_2P_SFN-12055PA6.5
  round 2 hole 1.3: 1(-3.25,0) 2(3.25,0)
CAP-TH_BD6.3-P2.50-D1.0-FD
  round 1.6 hole 1: 1(-1.27,0) 2(1.27,0)
CONN-TH_2P-P3.81_DB125-3.81-2P-BK-S
  round 2.5 hole 1.5: 1(-1.905,0) 2(1.905,0)
DIP-8_L9.7-W6.4-P2.54-LS7.6-BL
  rect 1.8x1.8 hole 1: 1(-3.81,-3.81)
  round 1.8 hole 1: 2(-1.27,-3.81) 3(1.27,-3.81) 4(3.81,-3.81) 5(3.81,3.81) 6(1.27,3.81) 7(-1.27,3.81) 8(-3.81,3.81)
DO-41_BD2.4-L4.7-P8.70-D0.9-RD
  round 1.8 hole 1: 1(-4.35,0) 2(4.35,0)
HDR-TH_2P-P2.54-V-M-1
  rect 1.8x1.8 hole 1: 1(-1.27,0)
  round 1.8 hole 1: 2(1.27,0)
HDR-TH_4P-P2.54-V-M
  rect 1.7x1.7 hole 1.1: 1(-3.81,0)
  round 1.7 hole 1.1: 2(-1.27,0) 3(1.27,0) 4(3.81,0)
HDR-TH_6P-P2.54-V-M-1
  rect 1.8x1.8 hole 1.2: 1(-6.35,0)
  round 1.8 hole 1.2: 2(-3.81,0) 3(-1.27,0) 4(1.27,0) 5(3.81,0) 6(6.35,0)
HDR-TH_25P-P2.54-V-M
  rect 1.6x1.6 hole 1.05: 1(-30.48,0)
  round 1.6 hole 1.05: 2(-27.94,0) 3(-25.4,0) 4(-22.86,0) 5(-20.32,0) 6(-17.78,0) 7(-15.24,0) 8(-12.7,0) 9(-10.16,0) 10(-7.62,0) 11(-5.08,0) 12(-2.54,0) 13(0,0) 14(2.54,0) 15(5.08,0) 16(7.62,0) 17(10.16,0) 18(12.7,0) 19(15.24,0) 20(17.78,0) 21(20.32,0) 22(22.86,0) 23(25.4,0) 24(27.94,0) 25(30.48,0)
HEATSINK-TH_L15.5-W10.5-XSD1226-005
  round 2.4 hole 1.6: 1(0,0)
Key_SMD_12x12x7.3
  rect 2.999x1.999 smd: 1(-7.5,-2.499) 2(7.5,-2.499) 3(7.5,2.499) 4(-7.5,2.499)
LED-TH_BD3.8-P2.54-FD_GREEN
  round 1.524 hole 0.9: 1(-1.27,0) 2(1.27,0)
LED-TH_BD5.8-P2.54-FD
  rect 1.6x1.6 hole 1: 1(-1.27,0)
  round 1.6 hole 1: 2(1.27,0)
LED_TH-3mm
  round 1.524 hole 0.914: 1(-1.27,0) 2(1.27,0)
OPTO-TH_ITR9909
  round 1.524 hole 0.914: 1(-2.05,1.27) 2(-2.05,-1.27) 3(2.05,-1.27) 4(2.05,1.27)
RES-ADJ-TH_3P-L10.0-W10.0-P2.50-L
  round 1.524 hole 0.762: 1(-2.5,0) 2(0,0) 3(2.5,0)
RES-TH_BD2.3-L6.5-P10.50-D0.5
  round 1.4 hole 0.7: 1(-5.25,0) 2(5.25,0)
RES-TH_BD2.4-L6.3-P10.30-D0.6
  round 1.524 hole 1: 1(-5.15,0) 2(5.15,0)
SOP-8_L4.9-W3.9-P1.27-LS6.0-BL
  oval 0.63x1.865 smd: 1(-1.905,-2.683) 2(-0.635,-2.683) 3(0.635,-2.683) 4(1.905,-2.683) 5(1.905,2.683) 6(0.635,2.683) 7(-0.635,2.683) 8(-1.905,2.683)
SW-TH_SK-12E12-G5
  round 1.524 hole 1: 1(0,3.175) 2(0,0.127) 3(0,-2.921)
  round 2.2 hole 1.5: 4(0,-6.477) 5(0,6.477)
TO-92-3_L4.8-W3.7-P2.54-L
  rect 1.8x1.8 hole 1: 1(-2.54,0)
  round 1.8 hole 1: 2(0,0) 3(2.54,0)
TO-220-3_L10.0-W4.5-P2.54-L
  rect 1.8x2.6 hole 1.2: 1(-2.54,0.005)
  oval 1.8x2.6 hole 1.2: 2(0,0.005) 3(2.54,-0.005)

## Nets
As in the schematic.

Pads without a net: H2 23 24; SW2 3; U2 1; U16 5 6 7

## Via types
v1: diameter 0.61, hole 0.305, Top Layer to Bottom Layer, 649 vias

## Routing (per net, layer and track width the routed paths; a pad name or vN(x,y) marks a point on that pad's centre or on a via; arc(x,y) is an arc through that point)
+5V: length 433.2
  Top Layer w0.3: v1(29.08,57.33) 27.3,59.11 R29.2 28.83,60.74 28.83,65.33 28.19,65.33 v1(26.92,66.6) ; v1(36.83,50.09) 38.35,48.56 R9.2 ; R28.2 31.6,59.34 R27.2 35.66,59.12 R23.2 ; v1(36.83,53.77) 38.23,55.17 40.77,55.17 42.04,56.44 42.04,56.82
  Top Layer w0.5: 4.75,31.73 8.97,27.5 D2.1 17.4,24.56 16.51,23.67 16.51,17.7 17.65,16.56 29.34,16.56 v1(30.48,15.42) ; v1(28.83,69.52) 28.88,69.52 R32.2 ; v1(30.35,13.39) 32,11.74 32,11.61 ; BLUETOOTH.5 61.39,36.43 v1(61.85,36.88)
  Top Layer w1: U1.3 32,11.61 33.53,13.13 39.5,13.13 49.15,3.48 51.69,3.48 53.72,5.51 53.72,8.87 C2.1 ; 47.88,24.11 46.53,24.11 44.96,22.53 44.96,19.99 40.89,15.93 v1(34.92,15.93) ; R42.2 R41.2
  Bottom Layer w0.3: U18.8 27.48,55.73 v1(29.08,57.33) 29.58,57.33 R28.2 ; v1(36.83,50.09) v1(36.83,53.77) ; R9.2 36.96,45.15 U17.8 34.98,46.15 26.8,46.15 26.16,45.52 U16.8 ; R23.2 39.74,59.12 42.04,56.82 ; R25.3 56.27,71.3 46.86,71.3 45.34,69.77 43.57,69.77 R21.2 ; R42.2 11.03,69.9
  Bottom Layer w0.35: U1.3 32,10.25 30.95,9.2 3.68,9.2 0.51,12.37 0.51,66.95 R38.2
  Bottom Layer w0.45: R24.2 41.66,74.23 41.66,79.81 43.43,81.58 R22.2 43.82,82.66 43.82,84.63 43.05,85.39 39.88,85.39 38.48,86.79 38.48,91.36 35.81,94.03 H5.4
  Bottom Layer w0.5: v1(30.35,13.39) 30.48,13.51 v1(30.48,15.42) ; R32.2 R26.2 R24.2 41.1,71.98 R21.2 ; R33.2 1.91,81.83 1.91,70.92 2.95,69.87 R38.2 ; R20.3 R25.3 R30.3 R35.3 R40.3 61.8,43.41 62.1,43.1 62.1,37.13 v1(61.85,36.88) ; v1(26.92,66.6) 27.38,67.05 28.9,67.05 29.97,68.12 29.97,68.38 v1(28.83,69.52) 28.83,70.45 R31.2
  Bottom Layer w1: U1.3 32,13 v1(34.92,15.93) ; 12.79,83.59 6.74,83.59 6.64,83.69 R33.2 ; R38.2 6.45,69.87 R39.2 R42.2 ; BLUETOOTH.5 57.96,36.43 55.24,33.71 55.24,26.09 53.27,24.11 47.88,24.11
GND: length 103.7
  Top Layer w0.3: v1(13.72,50.98) 13.72,52.61 12.93,53.39 v1(11.18,53.39) 11.18,51.02 11.3,50.89 ; U6.3 11.56,42.21 9.49,40.15 v1(7.11,40.15) ; v1(1.14,59.61) 0.51,58.98 0.51,11.23 1.4,10.34 1.4,6.83 SW2.4 ; U4.3 17.53,50.34 v1(16.51,49.33) ; Q1.1 19.3,40.49 19.3,43.36 18.8,43.87 17.53,43.87 17.27,43.61 17.27,42.51 ; v1(13.08,57.58) 14.1,58.6 14.1,60.38 13.08,61.39 v1(10.41,61.39)
  Bottom Layer w0.3: v1(10.41,61.39) 2.92,61.39 v1(1.14,59.61) ; v1(11.18,53.39) 11.18,55.68 v1(13.08,57.58) ; v1(13.72,50.98) 14.86,50.98 v1(16.51,49.33)
  vias: v1(2.39,37.93) v1(2.39,36.59) v1(2.67,41.45) v1(3.68,41.48) v1(3.68,40.15) v1(3.7,37.93) v1(3.7,36.59) v1(4.28,67.77) v1(4.28,66.44) v1(5.59,67.77) v1(5.59,66.44) v1(6.1,41.45) v1(6.1,40.18) v1(6.67,37.67) v1(6.67,36.34) v1(6.9,67.77) v1(6.9,66.44) v1(6.98,65.07) v1(6.98,63.8) v1(7.11,41.48) v1(7.98,37.67) v1(7.98,36.34) v1(8.21,67.77) v1(8.21,66.44) v1(8.26,65.07) v1(8.26,63.68) v1(9.28,66.44) v1(9.28,65.1) v1(9.27,63.68) v1(9.27,62.41) v1(9.29,37.67) v1(9.29,36.34) v1(10.6,37.67) v1(10.6,36.34) v1(10.8,66.47) v1(10.8,65.07) v1(10.8,63.68) v1(10.8,62.41) v1(11.9,66.44) v1(11.9,65.1) v1(13.21,66.44) v1(13.21,65.1) v1(32,63.17) v1(32,61.9) v1(33.4,63.17) v1(33.4,61.9) v1(34.4,63.2) v1(34.4,61.87) v1(35.71,63.2) v1(35.71,61.87) v1(36.68,63.2) v1(36.68,61.87) v1(37.99,63.2) v1(37.99,61.87) v1(38.97,63.2) v1(38.97,61.87) v1(40.28,63.2) v1(40.28,61.87)
VCC: length 153.1
  Top Layer w0.4: 12.83,41.07 12.95,41.2 17.91,41.2 18.54,41.83 U5.4 ; v1(18.42,52.5) 18.8,52.12 U4.4
  Top Layer w0.5: v1(11.05,40.82) 12.57,40.82 12.83,41.07 U6.4 ; v1(12.45,52.76) 12.45,51.01 U3.4 v1(12.57,49.33)
  Top Layer w1: C1.1 53.52,1.94 R16.1 ; v1(45.72,16.05) 47.24,17.58 v1(47.24,19.35)
  Bottom Layer w0.3: v1(11.05,40.82) 10.92,40.69
  Bottom Layer w0.4: v1(12.45,52.76) 12.95,52.25 16,52.25 16.26,52.5 v1(18.42,52.5)
  Bottom Layer w0.45: 10.92,40.69 10.92,38.53 12.83,36.63 12.83,32.05 13.97,30.91 17.91,30.91 20.7,28.12 24.89,28.12 27.05,25.95 39.42,25.95 R13.2
  Bottom Layer w0.5: 10.92,40.69 10.16,39.93 8.64,39.93 8,40.56 8,47.68 9.65,49.33 v1(12.57,49.33)
  Bottom Layer w1: U1.1 42.5,16.05 v1(45.72,16.05) ; U1.1 45.08,2.64 R16.1 ; U1.1 37.08,9.32 35.81,8.05 16.08,8.05 SW2.1 ; v1(47.24,19.35) 46.02,19.35 R13.2
(no net):
  vias: v1(3.82,94.91) v1(3.82,93.58) v1(5.14,94.91) v1(5.14,93.58) v1(5.91,22.31) v1(5.91,20.97) v1(5.91,19.64) v1(5.91,18.31) v1(5.91,16.97) v1(5.91,15.64) v1(6.01,13.36) v1(6.01,12.03) v1(6.08,80.64) v1(6.08,79.33) v1(6.08,78.01) v1(6.08,76.7) v1(6.45,94.91) v1(6.45,93.58) v1(7.22,22.31) v1(7.22,20.97) v1(7.22,19.64) v1(7.22,18.31) v1(7.22,16.97) v1(7.22,15.64) v1(7.33,13.36) v1(7.33,12.03) v1(7.41,80.64) v1(7.41,79.33) v1(7.41,78.01) v1(7.41,76.7) v1(7.76,94.91) v1(7.76,93.58) v1(8.53,22.31) v1(8.53,20.97) v1(8.53,19.64) v1(8.53,18.31) v1(8.53,16.97) v1(8.53,15.64) v1(8.64,13.36) v1(8.64,12.03) v1(9.1,80.73) v1(9.1,79.42) v1(9.1,78.11) v1(9.1,76.79) v1(9.72,94.82) v1(9.72,93.49) v1(9.84,22.31) v1(9.84,20.97) v1(9.84,19.64) v1(9.84,18.31) v1(9.84,16.97) v1(9.84,15.64) v1(9.95,13.36) v1(9.95,12.03) v1(10.44,80.73) v1(10.44,79.42) v1(10.44,78.11) v1(10.44,76.79) v1(11.03,94.82) v1(11.03,93.49) v1(11.24,22.31) v1(11.24,20.97) v1(11.24,19.77) v1(11.24,18.43) v1(11.24,16.97) v1(11.24,15.64) v1(11.37,13.42) v1(11.37,12.08) v1(12.13,80.71) v1(12.13,79.4) v1(12.13,78.08) v1(12.13,76.77) v1(12.34,94.82) v1(12.34,93.49) v1(12.41,90.37) v1(12.41,89.06) v1(12.55,22.31) v1(12.55,20.97) v1(12.55,19.77) v1(12.55,18.43) v1(12.55,16.97) v1(12.55,15.64) v1(12.68,13.42) v1(12.68,12.08) v1(13.46,80.71) v1(13.46,79.4) v1(13.46,78.08) v1(13.46,76.77) v1(13.65,94.82) v1(13.65,93.49) v1(13.75,90.37) v1(13.75,89.06) v1(13.86,22.31) v1(13.86,20.97) v1(13.86,19.77) v1(13.86,18.43) v1(13.86,16.97) v1(13.86,15.64) v1(13.99,13.42) v1(13.99,12.08) v1(15.18,22.31) v1(15.18,20.97) v1(15.18,19.77) v1(15.18,18.43) v1(15.18,16.97) v1(15.18,15.64) v1(15.3,94.82) v1(15.3,93.49) v1(15.3,13.42) v1(15.3,12.08) v1(16.62,94.82) v1(16.62,93.49) v1(17.93,94.82) v1(17.93,93.49) v1(19.24,94.82) v1(19.24,93.49) v1(22.67,18.62) v1(22.67,17.29) v1(23.97,90.5) v1(23.97,89.18) v1(23.98,18.62) v1(23.98,17.29) v1(24.35,98.16) v1(24.35,96.85) v1(24.35,95.53) v1(24.35,94.22) v1(24.61,26.02) v1(24.61,24.71) v1(24.61,23.4) v1(24.61,22.09) v1(25.3,90.5) v1(25.3,89.18) v1(25.29,18.62) v1(25.29,17.29) v1(25.69,98.16) v1(25.69,96.85) v1(25.69,95.53) v1(25.69,94.22) v1(25.94,26.02) v1(25.94,24.71) v1(25.94,23.4) v1(25.94,22.09) v1(26.54,75.23) v1(26.54,74.35) v1(26.61,18.62) v1(26.61,17.29) v1(27.04,25.12) v1(27.04,23.78) v1(27.15,30.69) v1(27.15,29.38) v1(27.15,28.07) v1(27.3,75.23) v1(27.94,74.35) v1(28.36,25.12) v1(28.36,23.78) v1(28.48,30.69) v1(28.48,29.38) v1(28.48,28.07) v1(28.48,26.75) v1(29.67,25.12) v1(29.67,23.78) v1(30.08,75.01) v1(30.08,73.68) v1(30.29,27.9) v1(30.67,94.19) v1(30.67,92.86) v1(30.98,25.12) v1(30.98,23.78) v1(31.39,75.01) v1(31.39,73.68) v1(31.6,80.22) v1(31.6,78.89) v1(31.6,27.9) v1(31.86,65.66) v1(31.85,64.84) v1(31.98,94.19) v1(31.98,92.86) v1(32.2,25.12) v1(32.2,23.78) v1(32.73,68.12) v1(32.83,20.91) v1(32.83,19.58) v1(32.91,80.22) v1(32.91,78.89) v1(32.91,27.9) v1(33.17,65.66) v1(33.19,64.84) v1(33.3,94.19) v1(33.3,92.86) v1(33.4,70.06) v1(33.4,68.73) v1(33.51,25.12) v1(33.51,23.78) v1(34.07,68.12) v1(34.23,27.9) v1(34.14,20.91) v1(34.14,19.58) v1(34.39,65.58) v1(34.39,64.82) v1(34.61,94.19) v1(34.61,92.86) v1(34.83,25.12) v1(34.83,23.78) v1(35.45,20.91) v1(35.45,19.58) v1(35.72,65.58) v1(35.72,64.82) v1(36.14,25.12) v1(36.14,23.78) v1(36.17,80.98) v1(36.17,79.65) v1(36.17,78.57) v1(36.17,77.23) v1(36.17,76.16) v1(36.42,90.24) v1(36.42,88.93) v1(36.8,68.25) v1(36.8,65.58) v1(36.8,64.82) v1(36.77,20.91) v1(36.77,19.58) v1(37.18,28.27) v1(37.49,80.98) v1(37.49,79.65) v1(37.49,78.57) v1(37.49,77.23) v1(37.49,76.16) v1(37.49,74.82) v1(37.49,70.28) v1(37.49,68.95) v1(37.75,90.24) v1(37.75,88.93) v1(38.13,68.25) v1(38.13,65.58) v1(38.13,64.82) v1(38.42,20.78) v1(38.42,19.45) v1(38.49,28.27) v1(38.49,26.93) v1(39.73,20.78) v1(39.73,19.45) v1(39.8,28.27) v1(39.8,26.93) v1(40.58,94.19) v1(40.58,92.86) v1(40.86,68.25) v1(41.12,28.27) v1(41.12,26.93) v1(41.04,20.78) v1(41.04,19.45) v1(41.53,70.44) v1(41.53,69.11) v1(41.89,94.19) v1(41.89,92.86) v1(42.2,68.25) v1(42.16,28.27) v1(42.16,26.93) v1(42.16,25.98) v1(42.16,24.65) v1(42.35,20.78) v1(42.35,19.45) v1(42.78,79.68) v1(42.78,78.34) v1(42.78,77.18) v1(42.78,75.85) v1(43.2,94.19) v1(43.2,92.86) v1(43.47,28.27) v1(43.47,26.93) v1(43.47,25.98) v1(43.47,24.65) v1(44.04,86.81) v1(44.04,85.5) v1(44.09,79.68) v1(44.09,78.34) v1(44.09,77.18) v1(44.09,75.85) v1(44.51,94.19) v1(44.51,92.86) v1(44.78,28.27) v1(44.78,26.93) v1(44.78,25.98) v1(44.78,24.65) v1(45.37,86.81) v1(45.37,85.5) v1(45.78,94.19) v1(45.78,92.86) v1(46.09,28.27) v1(46.09,26.93) v1(46.09,25.98) v1(47.1,94.19) v1(47.1,92.86) v1(48.41,94.19) v1(48.41,92.86) v1(48.48,91.89) v1(48.48,90.58) v1(49.72,94.19) v1(49.72,92.86) v1(49.82,91.89) v1(49.82,90.58) v1(50.39,87.07) v1(50.39,85.75) v1(50.39,84.78) v1(50.39,83.47) v1(51.4,16.12) v1(51.4,14.8) v1(51.4,13.49) v1(51.4,12.18) v1(51.72,87.07) v1(51.72,85.75) v1(51.72,84.78) v1(51.72,83.47) v1(52.29,97.02) v1(52.29,95.7) v1(52.29,94.39) v1(52.29,93.08) v1(52.67,66.1) v1(52.67,64.81) v1(52.68,48.71) v1(52.68,47.4) v1(52.65,46.14) v1(52.65,44.83) v1(52.74,16.12) v1(52.74,14.8) v1(52.74,13.49) v1(52.74,12.18) v1(53.05,58.11) v1(53.05,56.8) v1(53.24,30.34) v1(53.24,29.03) v1(53.24,27.72) v1(53.24,26.4) v1(53.44,82.24) v1(53.44,80.93) v1(53.63,97.02) v1(53.63,95.7) v1(53.63,94.39) v1(53.63,93.08) v1(53.72,46.15) v1(53.72,44.88) v1(53.83,66.1) v1(53.83,64.81) v1(53.75,48.72) v1(53.75,47.45) v1(54.45,87.07) v1(54.45,85.75) v1(54.45,84.65) v1(54.45,83.34) v1(54.77,82.24) v1(54.77,80.93) v1(54.87,63.56) v1(54.87,62.24) v1(54.98,66.1) v1(54.98,64.81) v1(55.79,87.07) v1(55.79,85.75) v1(55.79,84.65) v1(55.79,83.34) v1(56.13,66.1) v1(56.13,64.81) v1(56.2,63.56) v1(56.2,62.24) v1(57.88,86.22) v1(57.88,84.91) v1(57.88,83.6) v1(57.88,82.28) v1(57.91,81.18) v1(57.91,79.87) v1(59.21,86.22) v1(59.21,84.91) v1(59.21,83.6) v1(59.21,82.28) v1(59.24,81.18) v1(59.24,79.87) v1(60.55,86.22) v1(60.55,84.91) v1(60.55,83.6) v1(60.55,82.28) v1(60.55,81.22) v1(60.55,79.91) v1(61.06,95.87) v1(61.06,94.56) v1(61.06,93.25) v1(61.06,91.94) v1(61.06,90.92) v1(61.06,89.61) v1(61.06,88.29) v1(61.06,86.98) v1(61.88,86.22) v1(61.88,84.91) v1(61.88,83.6) v1(61.88,82.28) v1(61.88,81.22) v1(61.88,79.91) v1(62.39,95.87) v1(62.39,94.56) v1(62.39,93.25) v1(62.39,91.94) v1(62.39,90.92) v1(62.39,89.61) v1(62.39,88.29) v1(62.39,86.98)
ADC: length 81.5
  Top Layer w0.3: 47.88,72.62 48.13,72.37 v1(50.42,72.37) ; R14.2 39.15,24.2 v1(35.56,27.79) ; R15.1 37.33,30.78 51,30.78 54.99,34.77 54.99,41.12 54.48,41.63 54.48,48.87 55.12,48.87 56.9,50.65 56.9,70.72 54.99,72.62 52.7,72.62 v1(52.58,72.49)
  Top Layer w0.4: R15.1 35.37,30.14 v1(35.43,30.08)
  Bottom Layer w0.3: v1(52.58,72.49) 50.55,72.49 v1(50.42,72.37)
  Bottom Layer w0.45: v1(35.43,30.08) 35.43,27.92 v1(35.56,27.79)
BAT: length 38.6
  Bottom Layer w1: U19.2 53.29,17.96 28.7,17.96 23.88,13.13 23.88,11.57 D1.2
BT-EN: length 48.9
  Top Layer w0.3: v1(53.59,74.78) 54.36,74.02 58.8,74.02 60.83,71.99 60.83,42.65 v1(60.2,42.01)
  Bottom Layer w0.3: 47.88,77.7 50.67,77.7 v1(53.59,74.78) ; v1(60.2,42.01) 60.2,39.6 BLUETOOTH.6
BT-STATE: length 60.9
  Top Layer w0.3: v1(59.69,42.65) 60.2,43.16 60.2,71.6 58.47,73.34 53.64,73.34 v1(53.34,73.64) ; 47.88,75.16 v1(50.29,75.16)
  Bottom Layer w0.3: v1(59.69,42.65) 60.42,42.65 60.96,42.11 60.96,27.66 BLUETOOTH.1 ; v1(53.34,73.64) 51.82,73.64 v1(50.29,75.16)
BUZZER: length 19.7
  Top Layer w0.3: R18.1 31.59,29.73 32.39,28.93 47.63,28.93 47.88,29.19
ECHO: length 69.1
  Top Layer w0.3: v1(13.72,56.87) 14.73,57.89 v1(14.73,68.3) ; v1(16.64,54.46) 17.14,53.95 19.18,53.95 19.69,53.44 19.69,47.98 20.45,47.22 22.61,47.22 ; v1(13.97,72.37) 14.48,72.87 14.48,83.92 16.76,86.21 24.89,86.21 26.04,87.35 26.04,92.18 H5.2
  Bottom Layer w0.3: v1(14.73,68.3) 14.73,71.6 v1(13.97,72.37) ; v1(16.64,54.46) 16.64,55.48 15.24,56.87 v1(13.72,56.87)
KEY: length 65.6
  Top Layer w0.3: v1(50.42,31.73) 47.88,31.73 ; v1(50.42,29.44) 50.42,16.61 48.17,14.37 3.42,14.37
  Bottom Layer w0.3: v1(50.42,29.44) v1(50.42,31.73)
LED-L: length 101.2
  Top Layer w0.3: v1(19.18,34.47) v1(11.94,34.47) ; R11.2 22.27,93.95 20.7,92.38 4.32,92.38 1.02,89.08 1.02,66.47 1.78,65.7 1.78,35.86 3.18,34.47 v1(6.22,34.47) ; v1(10.41,34.47) v1(8.51,34.47)
  Bottom Layer w0.3: v1(11.94,34.47) v1(10.41,34.47) ; v1(8.51,34.47) v1(6.22,34.47) ; v1(19.18,34.47) 19.23,34.52 22.61,34.52
LED-R: length 41.2
  Top Layer w0.3: v1(25.4,82.78) 22.86,80.24 22.61,80.24 ; v1(37.34,84.18) 36.32,85.19 v1(31.5,85.19) ; R10.2 50.72,90.44 48.89,88.62 48.89,87.73 48.64,87.73 45.08,84.18 v1(42.16,84.18)
  Bottom Layer w0.3: v1(25.4,82.78) 26.54,83.92 27.56,83.92 28.45,83.03 29.97,83.03 31.5,84.56 v1(31.5,85.19) ; v1(42.16,84.18) v1(37.34,84.18)
LH-B: length 43.3
  Top Layer w0.3: v1(37.47,41.76) 36.7,42.52 v1(26.04,42.52) ; U6.1 v1(9.02,41)
  Bottom Layer w0.3: v1(26.04,42.52) 24.51,42.52 23.62,43.41 21.72,43.41 20.83,42.52 10.54,42.52 v1(9.02,41) ; v1(37.47,41.76) 44.96,41.76 47.88,44.68
LH-F: length 56.1
  Top Layer w0.3: 47.88,47.22 49.66,49 v1(49.66,56.11) ; v1(42.29,52.3) 30.86,52.3 v1(28.7,50.14) ; 10.29,42.51 v1(10.29,44.17) ; v1(26.42,50.14) 24.77,48.49 v1(20.7,48.49)
  Bottom Layer w0.3: v1(20.7,48.49) 18.16,45.95 15.11,45.95 14.73,45.57 14.73,44.68 14.22,44.17 v1(10.29,44.17) ; v1(26.42,50.14) v1(28.7,50.14) ; v1(42.29,52.3) 46.1,56.11 v1(49.66,56.11)
LQ-B: length 22.5
  Top Layer w0.3: U3.1 8.02,50.14 v1(7.75,50.14)
  Bottom Layer w0.3: v1(7.75,50.14) 7.75,54.33 11.68,58.27 21.79,58.27 H2.11
LQ-F: length 25.4
  Top Layer w0.3: U3.2 v1(10.03,52.17) ; v1(24.13,51.03) 24.13,57.76 22.61,59.29 22.61,59.92
  Bottom Layer w0.3: v1(24.13,51.03) 21.79,51.03 21.21,51.61 12.57,51.61 12.01,52.17 v1(10.03,52.17)
MCU-RXD: length 72.8
  Top Layer w0.3: v1(41.91,66.27) v1(30.1,66.27) ; v1(50.17,37.57) v1(50.17,39.09) ; BLUETOOTH.3 54.23,31.35 v1(53.72,31.85) ; v1(49.91,41) 50.29,41.38 50.29,65 v1(49.02,66.27) ; 22.61,72.62 23.88,72.62 25.78,70.72 25.78,68.94 v1(28.45,66.27) ; v1(52.83,34.01) v1(51.44,35.41)
  Bottom Layer w0.3: v1(52.83,34.01) 53.72,33.12 v1(53.72,31.85) ; v1(50.17,39.09) 50.17,40.74 v1(49.91,41) ; v1(30.1,66.27) v1(28.45,66.27) ; v1(41.91,66.27) v1(49.02,66.27) ; v1(50.17,37.57) 51.44,36.3 v1(51.44,35.41)
MCU-TXD: length 74.1
  Top Layer w0.3: v1(39.62,65.58) 41.15,65.58 v1(41.66,65.07) ; v1(39.62,66.98) 30.23,66.98 v1(28.83,68.38) ; v1(54.23,54.28) v1(54.23,51.23) ; v1(54.23,63.04) v1(54.23,56.31) ; BLUETOOTH.2 61.21,30.46 61.21,34.34 60.45,35.1 58.8,35.1 57.66,36.25 v1(57.66,37.77) ; v1(57.02,48.44) v1(57.02,40.94)
  Bottom Layer w0.3: 22.61,70.08 22.93,70.08 24.64,68.38 v1(28.83,68.38) ; v1(54.23,63.04) 54.1,63.17 49.66,63.17 49.15,63.68 46.86,63.68 45.47,65.07 v1(41.66,65.07) ; v1(54.23,51.23) v1(57.02,48.44) ; v1(39.62,66.98) v1(39.62,65.58) ; v1(54.23,56.31) v1(54.23,54.28) ; v1(57.66,37.77) 57.66,40.31 v1(57.02,40.94)
P06: length 79.6
  Top Layer w0.3: v1(29.97,78.34) 30.1,78.21 33.27,78.21 35.37,80.3 R26.1 ; v1(25.65,59.03) v1(25.65,63.6) ; v1(37.21,40.87) v1(29.72,40.87) ; v1(20.07,67.79) 20.07,63.86 v1(20.19,63.73) ; LED5.2 17.72,78.97 19.94,78.97 20.7,78.21 v1(20.7,77.32) 22.23,77.32 23.24,78.34 v1(27.18,78.34) ; v1(23.37,63.73) v1(21.46,63.73) ; U17.7 v1(39.5,40.87) ; v1(25.4,57) 25.4,55.22 27.81,52.81 27.81,50.01 28.45,49.38 28.45,46.97 v1(29.97,45.44)
  Bottom Layer w0.3: v1(29.97,45.44) 29.97,41.12 v1(29.72,40.87) ; v1(20.07,67.79) 20.07,76.68 v1(20.7,77.32) ; v1(29.97,78.34) v1(27.18,78.34) ; v1(25.4,57) 25.4,58.78 v1(25.65,59.03) ; v1(39.5,40.87) v1(37.21,40.87) ; v1(25.65,63.6) 25.53,63.73 v1(23.37,63.73) ; v1(21.46,63.73) v1(20.19,63.73)
P13: length 56.8
  Top Layer w0.3: H5.3 31.88,95.48 30.48,95.48 26.92,91.92 26.92,87.1 v1(25.15,85.32)
  Bottom Layer w0.3: v1(25.15,85.32) 25.15,83.8 24.08,82.73 24.08,74.44 25.15,73.38 28.07,73.38 29.59,71.86 29.59,69.77 30.99,68.38 v1(30.99,63.35) 30.99,61.14 29.21,59.36 29.21,58.6 27.81,57.2 26.46,57.2 25.4,56.14 25.4,55.35 24.89,54.84 22.61,54.84
P14: length 19.1
  Top Layer w0.3: v1(18.16,57.63) 18.16,58.9 v1(19.3,60.05) ; v1(18.54,53.26) 18.15,53.26 17.54,52.66 17.12,52.66 16.26,51.79 U4.2
  Bottom Layer w0.3: v1(19.3,60.05) 19.3,63.86 20.19,64.75 22.35,64.75 22.61,65 ; v1(18.16,57.63) 18.16,56.62 18.92,55.86 18.92,53.64 v1(18.54,53.26)
P15: length 23
  Top Layer w0.3: v1(19.43,57.63) v1(19.43,58.9) ; v1(20.83,50.65) v1(20.83,52.55) ; U4.1 v1(14.99,49.25)
  Bottom Layer w0.3: H2.9 22.73,62.21 v1(19.43,58.9) ; v1(20.83,52.55) 19.43,53.95 v1(19.43,57.63) ; v1(20.83,50.65) 20.83,49.83 19.3,48.31 15.93,48.31 v1(14.99,49.25)
P22: length 39.6
  Top Layer w0.3: v1(38.48,49.76) 39.24,49 43.18,49 v1(43.69,49.51) ; v1(15.62,45.19) 14.73,44.3 U5.1
  Bottom Layer w0.3: v1(15.62,45.19) 18.42,45.19 21.72,48.49 24.26,48.49 25.91,46.84 36.32,46.84 38.48,49 v1(38.48,49.76) ; v1(43.69,49.51) 47.63,49.51 47.88,49.76
P23: length 43.7
  Top Layer w0.3: v1(36.83,46.2) 35.31,44.68 v1(35.31,43.41) ; U5.2 v1(16,44.3) 16.46,44.75 v1(19.56,44.75) ; v1(35.43,41.89) 35.18,41.63 v1(26.42,41.63) ; v1(19.94,43.16) 19.94,41.89 v1(20.45,41.38) ; v1(40.13,49.89) v1(41.66,49.89)
  Bottom Layer w0.3: v1(19.56,44.75) 19.94,44.37 v1(19.94,43.16) ; v1(41.66,49.89) 41.91,49.89 44.07,52.05 47.63,52.05 47.88,52.3 ; v1(36.83,46.2) 36.83,46.59 v1(40.13,49.89) ; v1(26.42,41.63) 25.65,40.87 21.46,40.87 20.95,41.38 v1(20.45,41.38) ; v1(35.43,41.89) 35.43,43.28 v1(35.31,43.41)
P32: length 82.7
  Top Layer w0.3: R31.1 24.14,85.45 16.89,85.45 14.99,83.54 14.99,72.62 16.38,71.22 LED6.2 17.65,71.35 23.75,71.35 25.02,70.08 25.02,58.52 25.45,58.09 27.36,58.09 U18.7 ; v1(33.53,49.63) 33.53,47.09 32.51,46.08 v1(32.51,45.32)
  Bottom Layer w0.3: v1(33.53,49.63) 33.4,49.76 33.4,50.4 32,51.79 30.73,51.79 29.72,52.81 U18.7 ; 22.61,39.6 22.99,39.22 31.62,39.22 32.51,40.11 v1(32.51,45.32)
P33: length 58
  Top Layer w0.3: v1(27.43,45.19) 27.3,45.32 27.3,45.44 24.51,45.44 v1(24.26,45.19) ; v1(25.78,39.98) 22.86,37.06 22.61,37.06 ; v1(24.26,46.84) 25.91,46.84 U18.1 27.18,52.55 24.77,54.97 24.77,57.89 24.38,58.27 24.38,65.51 23.67,66.22 v1(21.46,66.22) ; LED7.2 18.1,68.49 v1(19.43,67.16)
  Bottom Layer w0.3: v1(27.43,45.19) 27.43,41.63 v1(25.78,39.98) ; R36.1 11.43,71.92 11.43,68.63 12.95,67.11 16.14,67.11 LED7.2 ; v1(24.26,46.84) v1(24.26,45.19) ; v1(21.46,66.22) 20.37,66.22 v1(19.43,67.16)
P47: length 69.9
  Top Layer w0.3: v1(30.1,64.11) 40.89,64.11 43.43,61.57 R21.1 43.43,55.48 v1(41.78,53.82) ; v1(28.19,64.11) 25.65,66.65 v1(25.65,66.73) ; U17.1 38.23,37.82 v1(38.23,42.9)
  Bottom Layer w0.3: v1(41.78,53.82) 40.89,52.94 40.89,47.98 39.5,46.59 39.5,45.7 38.99,45.7 38.23,44.93 v1(38.23,42.9) ; H2.7 24.06,67.49 24.82,66.73 v1(25.65,66.73) ; LED1.2 21.34,80.88 21.34,68.81 22.61,67.54 ; v1(30.1,64.11) v1(28.19,64.11)
P50: length 65.3
  Top Layer w0.3: U16.1 26.16,32.87 24.97,31.67 22.61,31.67 22.28,31.35 v1(20.7,31.35) ; v1(19.3,31.35) 17.02,31.35 15.24,29.57 9.02,29.57 7.75,30.84 7.75,34.14 4.57,37.31 v1(4.57,41.51)
  Bottom Layer w0.3: LED8.2 16.44,59.6 R41.1 11.87,59.6 8.89,56.62 5.33,56.62 4.7,55.98 4.7,41.63 v1(4.57,41.51) ; v1(19.3,31.35) v1(20.7,31.35)
$1N755: length 18.1
  Top Layer w0.3: LE-R.1 54.86,98.6 41.94,98.6 R10.1
$1N758: length 5.6
  Top Layer w0.3: LE-L.1 11.33,96.44 R11.1
$1N1456: length 21.9
  Top Layer w1: SW2.2 9.91,7.54 11.18,8.81 19.3,8.81 20.7,7.42 20.7,3.73 21.72,2.72 23.98,2.72 D1.1
$1N3806: length 8.6
  Top Layer w0.5: LQ.1 3.18,56.11 3.81,56.75 8.27,56.75 U3.8
  Top Layer w1: U3.8 U3.7
$1N3817: length 22.5
  Top Layer w0.5: v1(2.79,57.38) 8.26,57.38 8.51,57.63 11.94,57.63 12.07,57.51 11.3,56.75 11.3,56.25 U3.5
  Bottom Layer w0.5: LQ.2 3.18,50.4 2.54,50.4 1.78,51.16 1.78,56.36 v1(2.79,57.38)
$1N4327: length 14.1
  Top Layer w0.3: 16.26,55.86 U4.7
  Top Layer w0.5: v1(15.62,55.09) 16.26,55.73 16.26,55.86 ; RQ.1 13.21,54.84 14.48,53.57 v1(15.49,53.57)
  Top Layer w1: U4.7 U4.8
  Bottom Layer w0.5: v1(15.62,55.09) 15.62,53.7 v1(15.49,53.57)
$1N4331: length 17.5
  Top Layer w0.5: U4.5 U4.6 17.53,55.48 v1(18.29,54.71) ; v1(17.14,53.26) 16.19,53.26 15.73,52.81 14.22,52.81 12.83,54.21 8.13,54.21 RQ.2
  Bottom Layer w0.5: v1(18.29,54.71) 18.29,54.41 v1(17.14,53.26)
$1N4484: length 12.6
  Top Layer w0.5: v1(13.84,46.97) 14.73,47.86 U5.8 U5.7 ; v1(13.84,44.93) 7.75,44.93 RH.1
  Bottom Layer w0.5: v1(13.84,44.93) v1(13.84,46.97)
$1N4488: length 13.8
  Top Layer w0.5: RH.2 16.89,46.08 17.27,46.46 U5.6 U5.5
$1N4641: length 12.1
  Top Layer w0.5: U6.8 10.29,47.87 10.05,48.11 5.33,48.11 4.7,47.47 4.7,44.81 3.43,43.54 LH.1
$1N4645: length 13.9
  Top Layer w0.5: LH.2 3.05,47.73 4.57,49.25 11.45,49.25 U6.5 U6.6
$1N5248: length 3.8
  Top Layer w1: R14.1 R13.1
$1N5403: length 6.3
  Top Layer w1: LED4.1 49.4,7.92 R16.2
$1N6037: length 34.4
  Top Layer w0.3: v1(27.18,80.75) 25.15,80.75 23.37,78.97 21.46,78.97 18.67,81.76 LED1.1 ; v1(29.85,81.13) 29.74,81.13 29.23,80.62 29.23,77.81 29.46,77.57 33.02,77.57 v1(36.83,73.76) ; v1(40.01,73.89) 41.92,71.98 R22.1
  Bottom Layer w0.3: v1(27.18,80.75) 27.56,81.13 v1(29.85,81.13) ; v1(36.83,73.76) 36.96,73.89 v1(40.01,73.89)
$1N6091: length 45.7
  Top Layer w0.3: v1(42.8,63.86) 42.8,67.03 45.21,69.45 v1(45.21,71.48) ; U7.2 56.52,90.78 55.24,89.51 50.67,89.51 49.78,88.62 49.78,87.61 45.97,83.8 v1(45.97,73.51) ; R9.1 40.05,57.04 41.02,58.02 41.02,62.21 v1(41.15,62.33)
  Bottom Layer w0.3: v1(45.97,73.51) 45.97,72.24 v1(45.21,71.48) ; v1(41.15,62.33) 42.67,63.86 v1(42.8,63.86)
$1N6569: length 26.7
  Top Layer w0.3: v1(18.67,72.62) 19.94,73.89 23.62,73.89 25.65,75.92 v1(27.94,75.92) ; 17.65,76.49 17.65,76.05 v1(18.67,75.03) ; R27.1 33.27,71.8 33.27,74.65 32,75.92 v1(29.46,75.92)
  Bottom Layer w0.3: v1(29.46,75.92) v1(27.94,75.92) ; v1(18.67,72.62) v1(18.67,75.03)
$1N6571: length 20.3
  Top Layer w0.3: U9.2 38.1,85.23 38.1,70.89 R23.1
$1N6573: length 37.9
  Top Layer w0.3: v1(55.63,67.92) 55.63,69.37 R25.2 ; v1(45.21,68.18) 45.21,47.35 42.04,44.17
  Bottom Layer w0.3: v1(55.63,67.92) 52.7,67.92 51.75,68.88 45.91,68.88 v1(45.21,68.18)
$1N6588: length 54.2
  Top Layer w0.3: U9.4 42.93,88.5 42.93,86.21 39.4,82.69 R24.1 39.4,75.89 40.51,74.78 43.43,74.78 46.23,71.99 46.23,45.82 U17.5
$1N6939: length 18.2
  Top Layer w0.3: v1(29.85,79.35) 31.34,80.84 R32.1 ; v1(24.89,77.07) 24.26,76.43 21.84,76.43 19.18,73.76 LED6.1
  Bottom Layer w0.3: v1(29.85,79.35) 27.18,79.35 v1(24.89,77.07)
$1N6941: length 23.1
  Top Layer w0.3: v1(32.39,73.76) 32.64,73.51 32.64,70.33 31.92,69.62 R28.1 ; U11.2 v1(29.04,86.21) ; v1(30.61,84.81) 31.62,83.8 32.89,83.8 34.04,82.65 v1(34.04,79.99)
  Bottom Layer w0.3: v1(29.04,86.21) 29.21,86.21 v1(30.61,84.81) ; v1(34.04,79.99) 34.04,75.41 v1(32.39,73.76)
$1N6943: length 30.3
  Top Layer w0.3: v1(44.58,53.06) 34.92,53.06 U18.6 ; R30.2 55.75,60.65 55.75,56.49 54.74,55.48 v1(52.83,55.48)
  Bottom Layer w0.3: v1(44.58,53.06) 45.08,53.57 49.15,53.57 51.05,55.48 v1(52.83,55.48)
$1N6958: length 41.8
  Top Layer w0.3: U18.5 32.89,57.63 30.81,57.63 29.49,58.95 29.49,66.83 27.3,69.01 27.3,69.52 28.83,71.04 28.83,84.05 31.11,86.34 31.24,86.34 31.24,88.85 U11.4
$1N7309: length 22.2
  Top Layer w0.3: R37.1 8.28,74.78 6.1,74.78 5.33,74.02 5.33,72.87 7.24,70.97 13.59,70.97 15.49,69.06 15.49,67.98 LED7.1
$1N7311: length 31
  Top Layer w0.3: R33.1 3.77,80.32 5.08,81.64 5.08,84.05 6.73,85.7 13.21,85.7 13.97,86.46 13.97,87.86 15.54,89.43 19.6,89.43 20.95,90.78 U13.2
$1N7313: length 29.9
  Top Layer w0.3: U18.2 29.72,49.38 31.24,50.9 v1(44.45,50.9) ; v1(52.58,50.4) 55.5,50.4 55.88,50.78 55.88,51.86 R35.2
  Bottom Layer w0.3: v1(44.45,50.9) 44.58,51.03 51.94,51.03 v1(52.58,50.4)
$1N7328: length 68.3
  Top Layer w0.3: v1(8.26,75.54) 8.26,84.05 9.4,85.19 13.92,85.19 U13.4 ; U18.3 v1(32.26,49.63) ; v1(8.26,73.38) 6.84,73.38 R34.1 6.74,72.74 8,71.48 13.97,71.48 15.88,69.57 19.43,69.57 20.83,68.18 v1(20.83,57.38)
  Bottom Layer w0.3: v1(20.83,57.38) 20.83,54.33 21.59,53.57 25.15,53.57 27.81,50.9 31.62,50.9 32.26,50.27 v1(32.26,49.63) ; v1(8.26,75.54) v1(8.26,73.38)
$1N14798: length 9.2
  Bottom Layer w0.3: R42.1 13.41,63.22 LED8.1
$1N14800: length 37.2
  Top Layer w0.3: R38.1 3.43,64.75 1.65,66.52 1.65,86.72 4.45,89.51 6.86,89.51 8.13,90.78 U15.2
$1N14802: length 36.2
  Top Layer w0.3: v1(50.17,34.9) 50.17,34.01 49.48,33.32 46.53,33.32 v1(45.97,33.89) 45.85,33.89 45.47,34.27 30.48,34.27 28.7,36.04 U16.2 ; v1(54.23,40.49) v1(50.17,36.43) ; v1(55.75,40.36) 55.75,43.32 R40.2
  Bottom Layer w0.3: v1(54.23,40.49) 54.36,40.36 v1(55.75,40.36) ; v1(50.17,36.43) v1(50.17,34.9)
$1N14817: length 91
  Top Layer w0.3: v1(20.95,33.07) 23.88,33.07 v1(25.15,34.34) ; v1(14.73,35.23) 14.1,35.86 v1(14.1,37.9) ; v1(29.46,34.21) v1(26.8,34.21) ; v1(3.56,39.04) 2.67,39.93 v1(2.54,39.93) ; U15.4 2.16,85.47 2.16,67.03 6.48,62.71 R39.1 5.1,58.22 v1(2.54,58.22) ; v1(14.73,33.71) 15.37,33.07 v1(19.18,33.07) ; v1(5.33,39.04) v1(12.95,39.04)
  Bottom Layer w0.3: v1(14.73,33.71) v1(14.73,35.23) ; v1(26.8,34.21) 25.27,34.21 v1(25.15,34.34) ; v1(12.95,39.04) v1(14.1,37.9) ; U16.3 31.24,35.99 v1(29.46,34.21) ; v1(2.54,39.93) 1.14,41.33 1.14,56.82 v1(2.54,58.22) ; v1(3.56,39.04) v1(5.33,39.04) ; v1(20.95,33.07) v1(19.18,33.07)
$1N14919: length 9.6
  Top Layer w0.3: BUZZER2.2 11.25,36.25 Q1.3
$1N14930: length 39
  Top Layer w0.3: R19.2 31.58,22.46 R18.2 31.5,22.35 31.5,20.55 30.23,19.28 22.23,19.28 20.07,21.44 20.07,35.16 19.02,36.2 D2.2 Q1.2
$1N14943: length 66.3
  Top Layer w0.3: R20.2 55.66,75.12 56.13,74.65 59.31,74.65 61.47,72.49 61.47,41.51 60.71,40.74 57.91,40.74 v1(56.77,39.6) ; v1(54.36,39.6) 50.48,35.72 46.29,35.72 45.34,34.77 41.27,34.77 U17.2
  Bottom Layer w0.3: v1(54.36,39.6) v1(56.77,39.6)
$1N14947: length 61.1
  Top Layer w0.3: v1(44.58,48.49) 44.01,48.49 R12.1 42.04,46.33 40.77,45.06 40.77,42.39 42.04,41.12 42.04,36.55 ; U7.4 53.09,88.22 53.09,83.54 51.31,81.76 v1(51.31,49.38)
  Bottom Layer w0.3: v1(51.31,49.38) 50.42,48.49 v1(44.58,48.49)
$1N14951: length 72.3
  Top Layer w0.3: U17.4 44.58,37.31 45.59,38.33 48.39,38.33 51.94,41.89 51.94,74.4 53.47,75.92 53.47,77.77 R20.1 57.17,82.08 U7.1 58.93,88.24 59.82,89.13 59.82,91.54 58.55,92.81 55.1,92.81 U7.3

## Copper pours and planes (outline as drawn; the poured copper is in the pictures)
GND on Top Layer: 0,100 63,100 63,0 0,0
GND on Bottom Layer: 0,100 63,100 63,0 0,0

Small or netless copper shapes (teardrops, artwork), in the pictures only: 425 on Top Layer, 281 on Bottom Layer

## Text on the board
Top Silkscreen Layer: GND | Echo | TRIG | +5V | NPN | U15_Control | U9_Control | U13_Control | U7_Control | U11_Control | BO | FO | U11LED | U13LED | U15LED | U9LED | U7LED | Motor drive | BTE | MR | MT | BTS | honestliu.com | ADC电压检测 | 循迹 | STC8H8K64U核心板 | 智能小车控制板 | 誠君
